# EAGLE design Espressylu-0.7 (EAGLE 7.4.0)
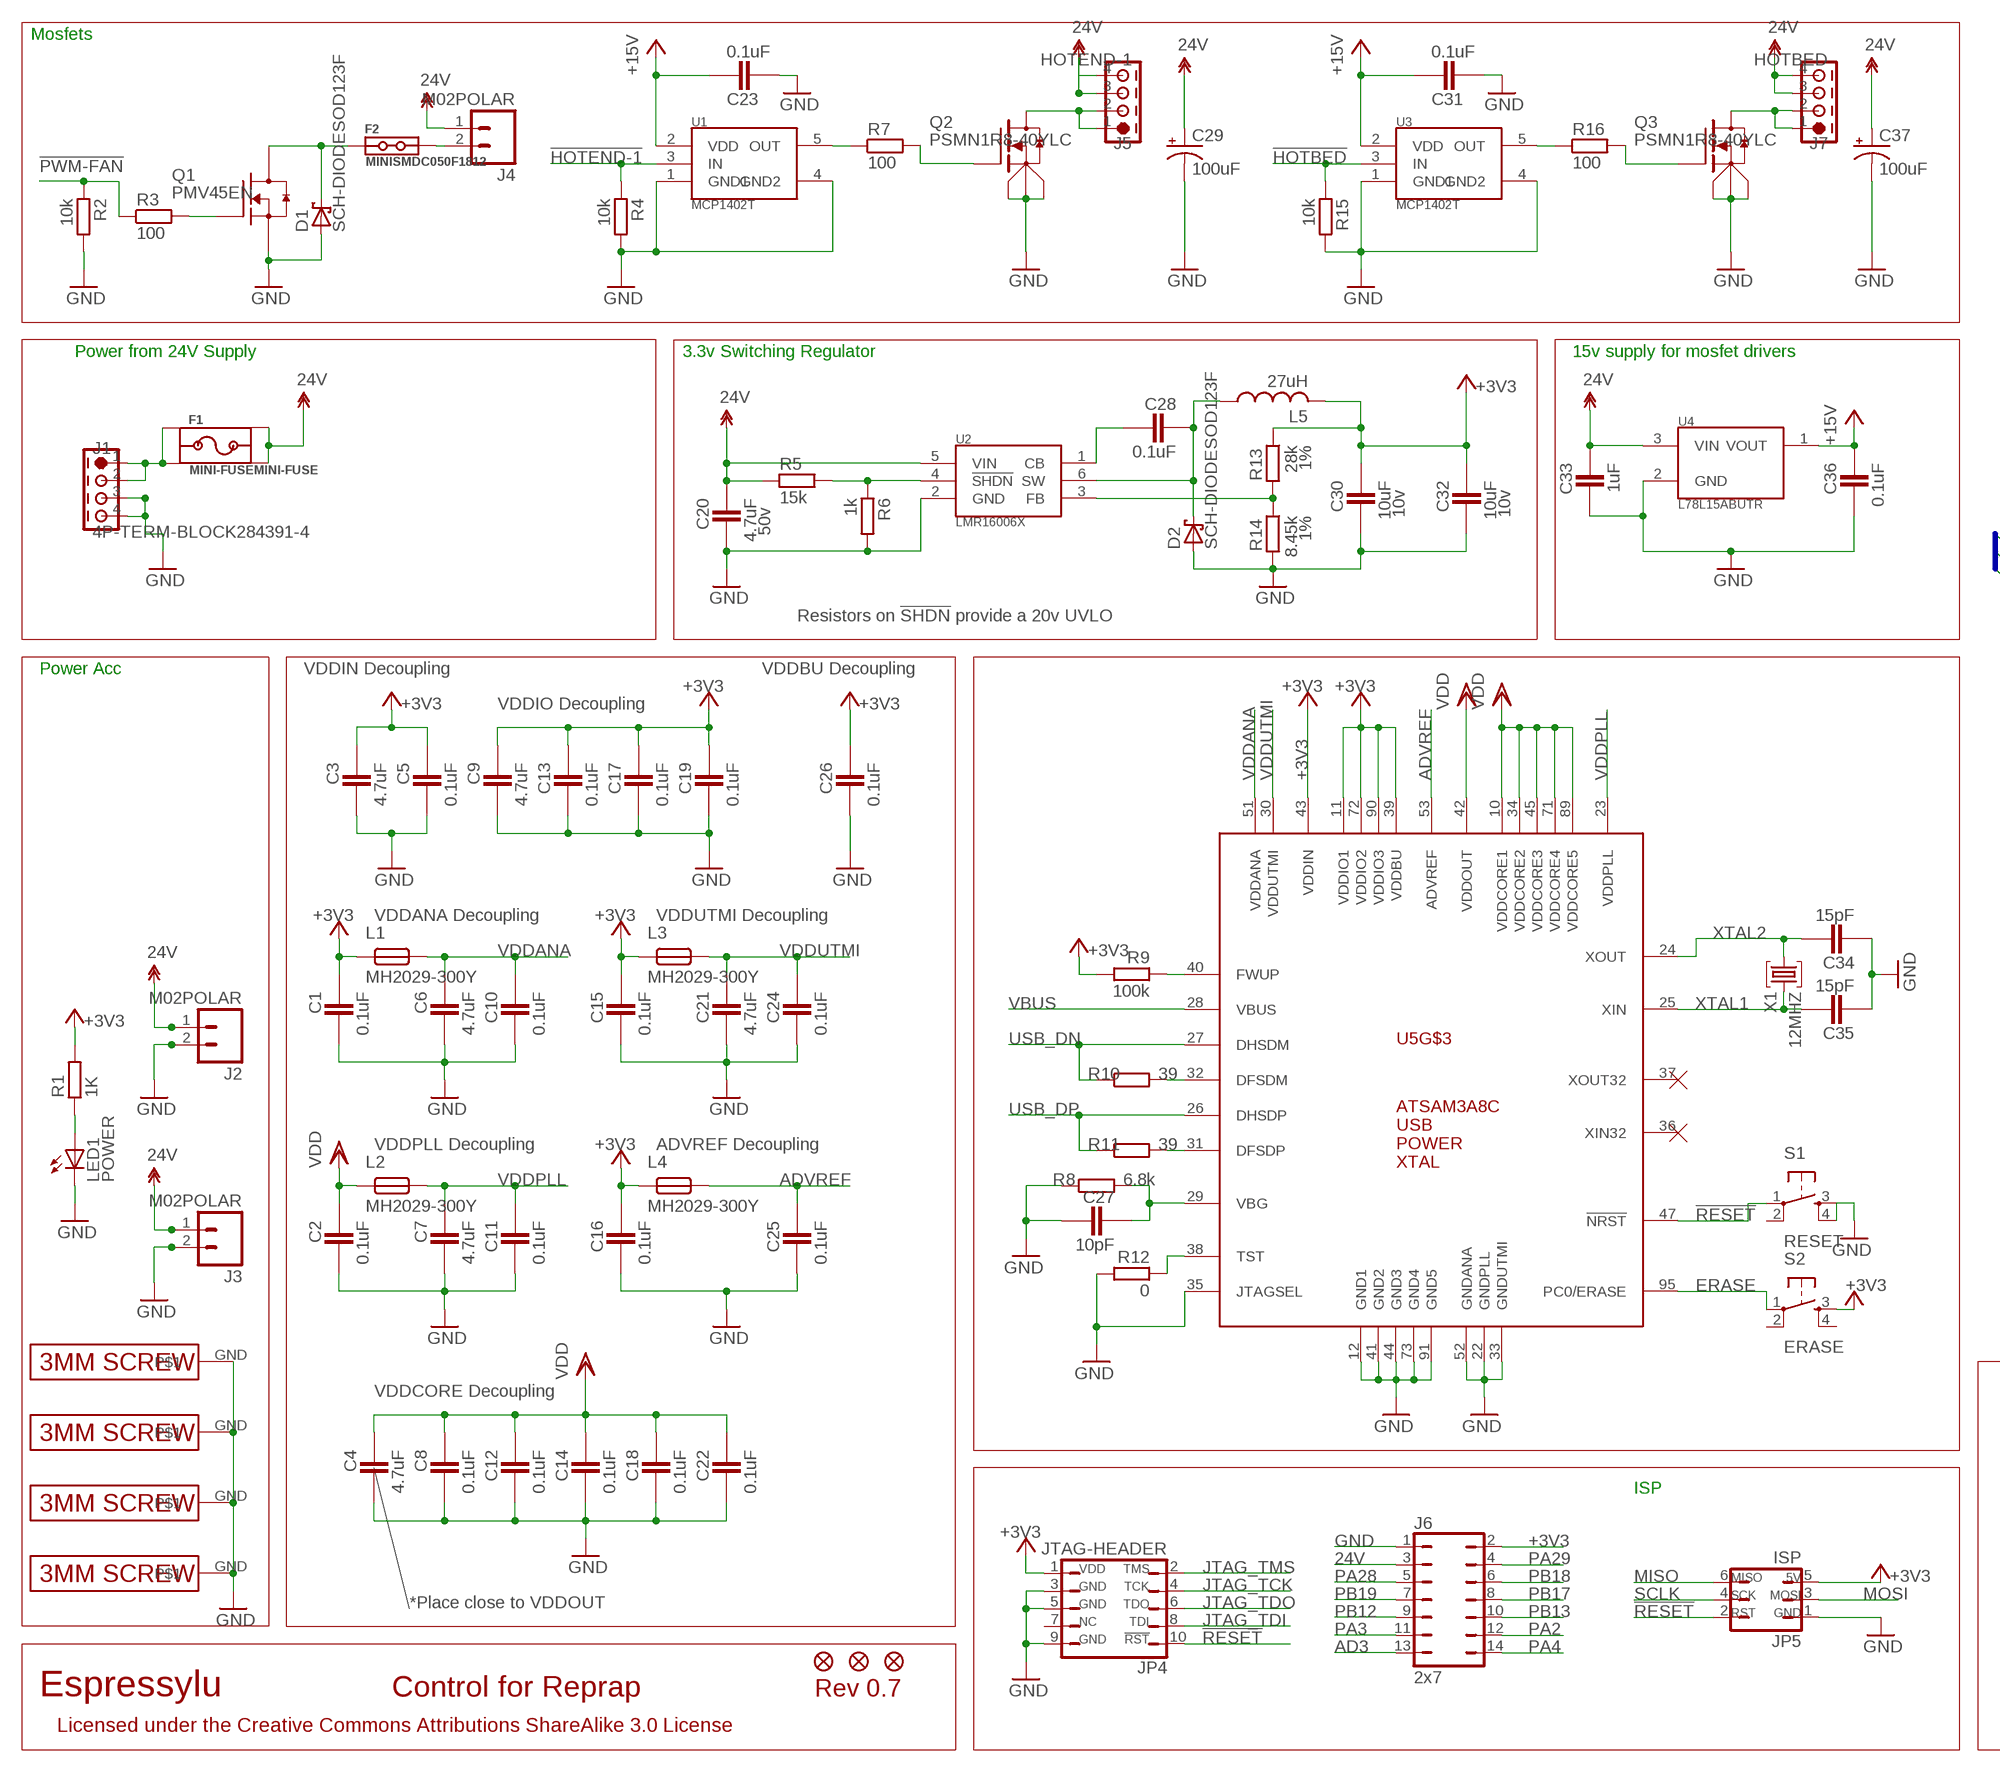
[diagram p0: schematic, sheet 1, part 1 of 2]
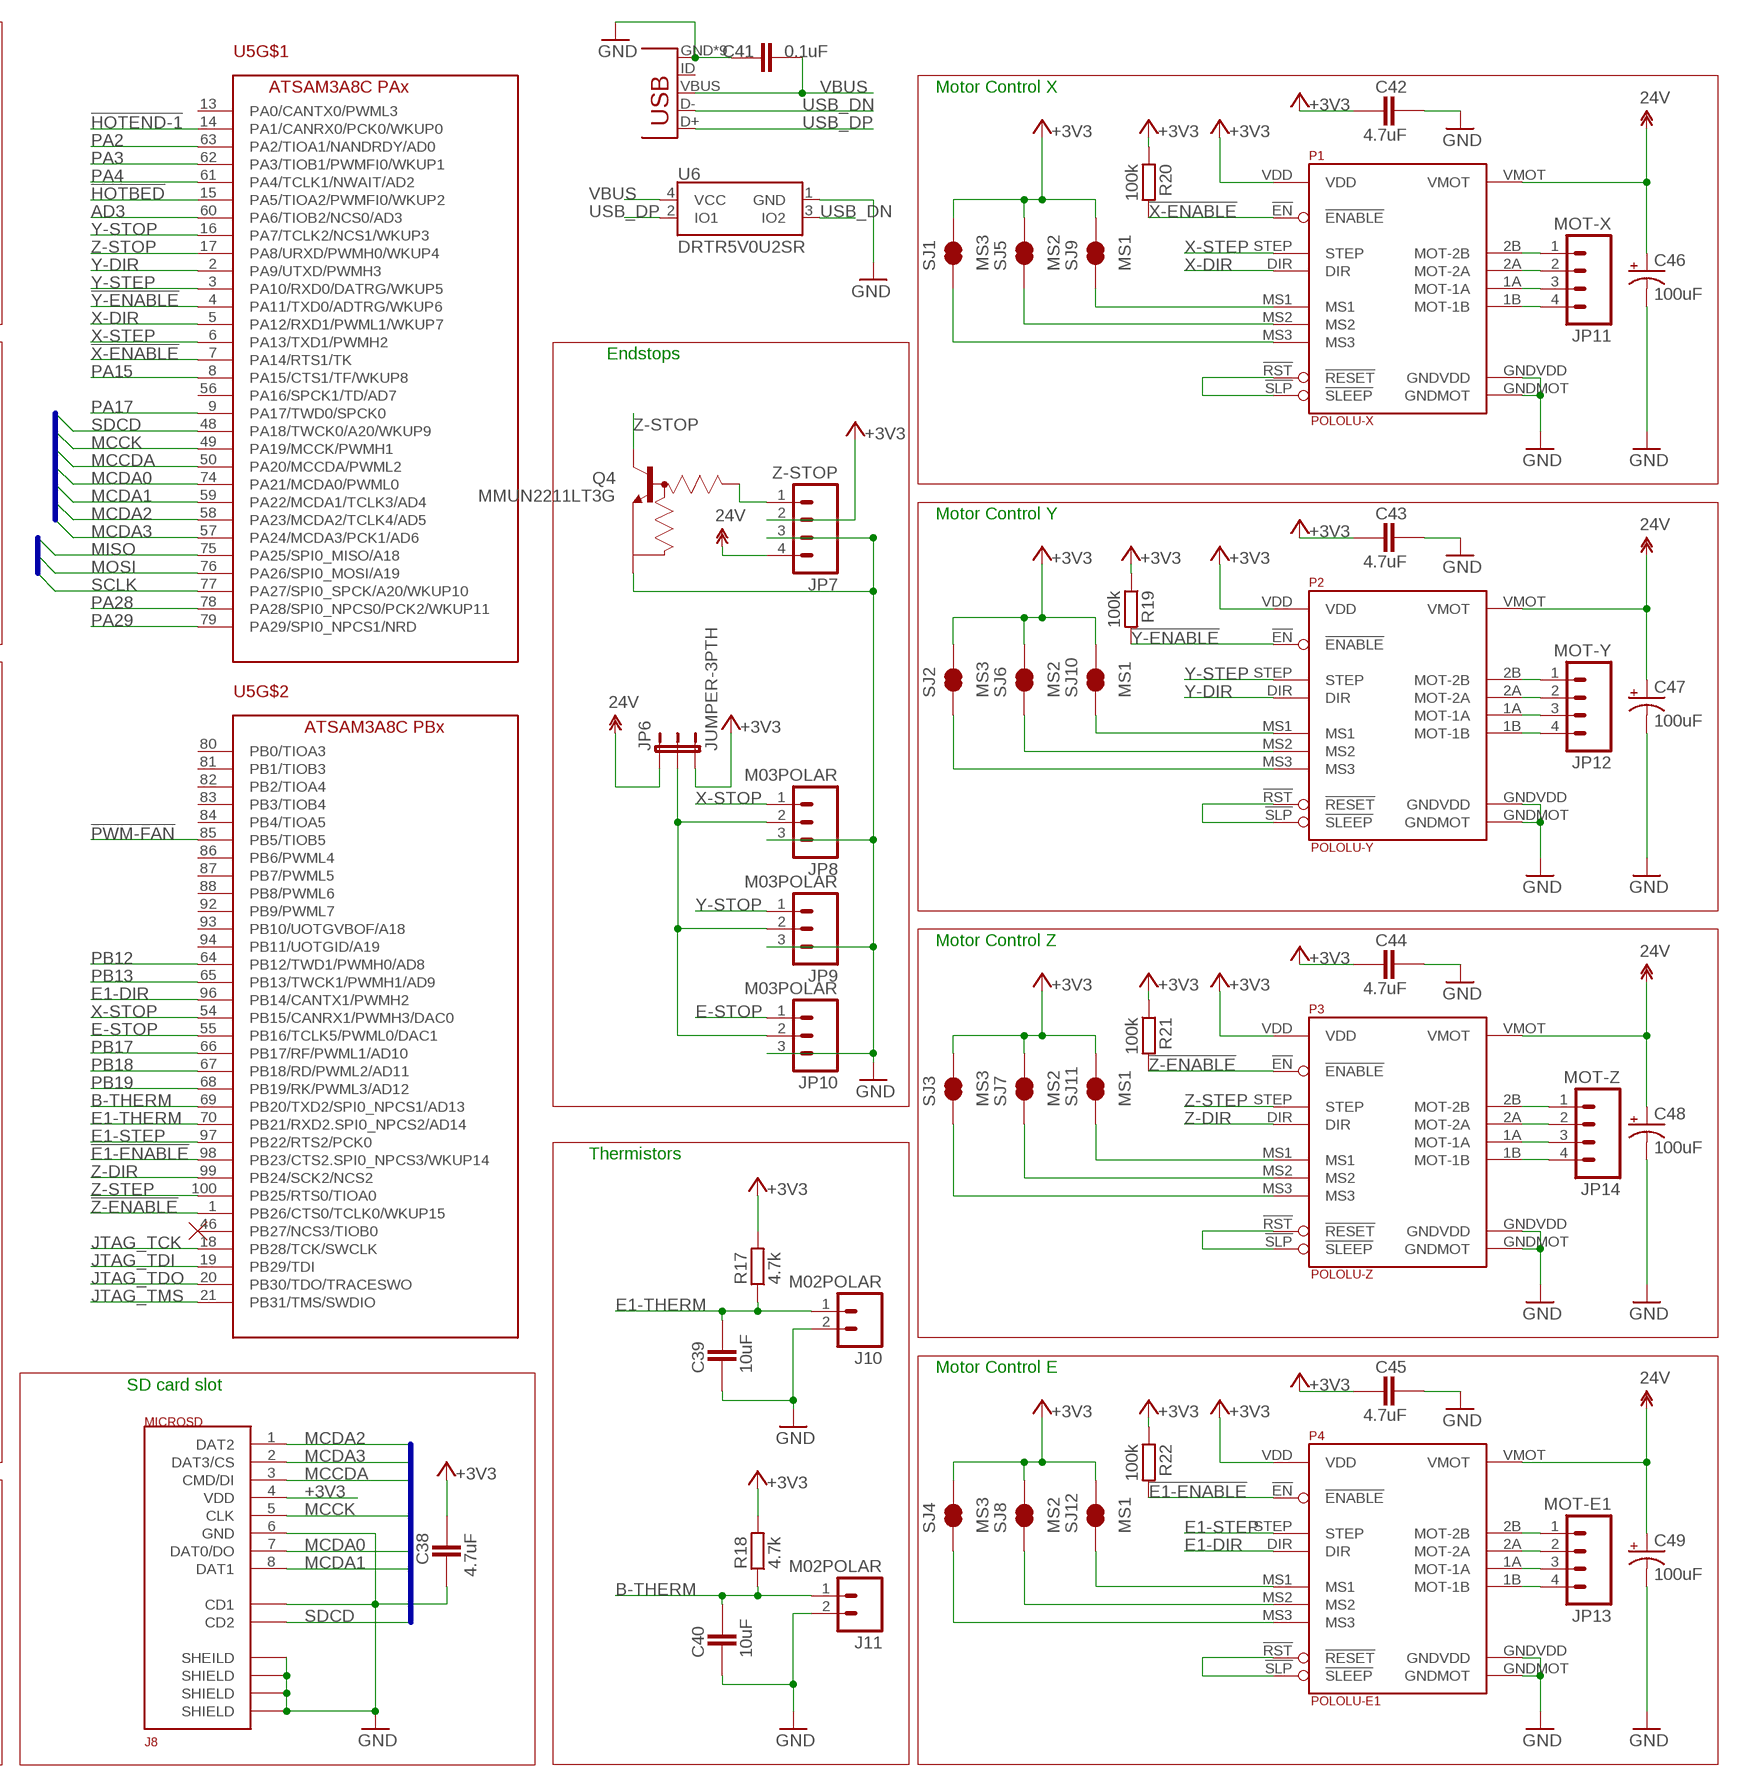
[diagram p1: schematic, sheet 1, part 2 of 2]

## Parts
C1  0.1uF  CAPACITOR_0402  [CAPC1005X60N]
C2  0.1uF  CAPACITOR_0402  [CAPC1005X60N]
C3  4.7uF  CAPACITOR_0603  [CAPC1608X92N]
C4  4.7uF  CAPACITOR_0603  [CAPC1608X92N]
C5  0.1uF  CAPACITOR_0402  [CAPC1005X60N]
C6  4.7uF  CAPACITOR_0603  [CAPC1608X92N]
C7  4.7uF  CAPACITOR_0603  [CAPC1608X92N]
C8  0.1uF  CAPACITOR_0402  [CAPC1005X60N]
C9  4.7uF  CAPACITOR_0603  [CAPC1608X92N]
C10  0.1uF  CAPACITOR_0402  [CAPC1005X60N]
C11  0.1uF  CAPACITOR_0402  [CAPC1005X60N]
C12  0.1uF  CAPACITOR_0402  [CAPC1005X60N]
C13  0.1uF  CAPACITOR_0402  [CAPC1005X60N]
C14  0.1uF  CAPACITOR_0402  [CAPC1005X60N]
C15  0.1uF  CAPACITOR_0402  [CAPC1005X60N]
C16  0.1uF  CAPACITOR_0402  [CAPC1005X60N]
C17  0.1uF  CAPACITOR_0402  [CAPC1005X60N]
C18  0.1uF  CAPACITOR_0402  [CAPC1005X60N]
C19  0.1uF  CAPACITOR_0402  [CAPC1005X60N]
C20  4.7uF  CAPACITOR_1206  [CAPC3215X168N]
C21  4.7uF  CAPACITOR_0603  [CAPC1608X92N]
C22  0.1uF  CAPACITOR_0402  [CAPC1005X60N]
C23  0.1uF  CAPACITOR_0402  [CAPC1005X60N]
C24  0.1uF  CAPACITOR_0402  [CAPC1005X60N]
C25  0.1uF  CAPACITOR_0402  [CAPC1005X60N]
C26  0.1uF  CAPACITOR_0402  [CAPC1005X60N]
C27  10pF  CAPACITOR_0402  [CAPC1005X60N]
C28  0.1uF  CAPACITOR_0402  [CAPC1005X60N]
C29  100uF  CPOL-USD  [PANASONIC_D]
C30  10uF  CAPACITOR_0805  [CAPC2012X145AN]
C31  0.1uF  CAPACITOR_0402  [CAPC1005X60N]
C32  10uF  CAPACITOR_0805  [CAPC2012X145AN]
C33  1uF  CAPACITOR_0402  [CAPC1005X60N]
C34  15pF  CAPACITOR_0402  [CAPC1005X60N]
C35  15pF  CAPACITOR_0402  [CAPC1005X60N]
C36  0.1uF  CAPACITOR_0402  [CAPC1005X60N]
C37  100uF  CPOL-USD  [PANASONIC_D]
C38  4.7uF  CAPACITOR_0603  [CAPC1608X92N]
C39  10uF  CAPACITOR_0402  [CAPC1005X60N]
C40  10uF  CAPACITOR_0402  [CAPC1005X60N]
C41  0.1uF  CAPACITOR_0402  [CAPC1005X60N]
C42  4.7uF  CAPACITOR_0603  [CAPC1608X92N]
C43  4.7uF  CAPACITOR_0603  [CAPC1608X92N]
C44  4.7uF  CAPACITOR_0603  [CAPC1608X92N]
C45  4.7uF  CAPACITOR_0603  [CAPC1608X92N]
C46  100uF  CPOL-USD  [PANASONIC_D]
C47  100uF  CPOL-USD  [PANASONIC_D]
C48  100uF  CPOL-USD  [PANASONIC_D]
C49  100uF  CPOL-USD  [PANASONIC_D]
D1  SCH-DIODESOD123F  [SOD123F]
D2  SCH-DIODESOD123F  [SOD123F]
F1  MINI-FUSEMINI-FUSE  [MINI_FUSE]
F2  MINISMDC050F1812  [MINISMDC]
J1  4P-TERM-BLOCK284391-4  [284391-4]
J2  M02POLAR  [MOLEX-1X2]
J3  M02POLAR  [MOLEX-1X2]
J4  M02POLAR  [MOLEX-1X2]
J5  HOTEND-1  4P-TERM-BLOCK284391-4  [284391-4]
J6  2x7  JP7Q  [JP7Q]
J7  HOTBED  4P-TERM-BLOCK284391-4  [284391-4]
J8  MICROSD  [AMPHENOL-MICROSD]
J9  USB-MICRO-PTH  [USB-MICROB-PTH]
J10  M02POLAR  [MOLEX-1X2]
J11  M02POLAR  [MOLEX-1X2]
JP1  FIDUCIAL1X2.5  [FIDUCIAL-1X2.5]
JP2  FIDUCIAL1X2.5  [FIDUCIAL-1X2.5]
JP3  FIDUCIAL1X2.5  [FIDUCIAL-1X2.5]
JP4  JTAG-HEADER  [2X05-0.5-SMD]
JP5  ISP  PROGHEADER  [ISP]
JP6  JUMPER-3PTH  [1X03]
JP7  Z-STOP  M04POLAR  [MOLEX-1X4]
JP8  M03POLAR  [MOLEX-1X3]
JP9  M03POLAR  [MOLEX-1X3]
JP10  M03POLAR  [MOLEX-1X3]
JP11  MOT-X  M04POLAR  [MOLEX-1X4]
JP12  MOT-Y  M04POLAR  [MOLEX-1X4]
JP13  MOT-E1  M04POLAR  [MOLEX-1X4]
JP14  MOT-Z  M04POLAR  [MOLEX-1X4]
L1  MH2029-300Y  FERRITE_BEAD_0805  [FERRITE_BEAD_0805]
L2  MH2029-300Y  FERRITE_BEAD_0805  [FERRITE_BEAD_0805]
L3  MH2029-300Y  FERRITE_BEAD_0805  [FERRITE_BEAD_0805]
L4  MH2029-300Y  FERRITE_BEAD_0805  [FERRITE_BEAD_0805]
L5  27uH  INDUCTORSDR0604  [SDR0604]
LED1  POWER  LEDCHIPLED_0805  [CHIPLED_0805]
P1  POLOLU-X  POLOLU-ALLEGRO  [POLOLU-STEPPER-PTH]
P2  POLOLU-Y  POLOLU-ALLEGRO  [POLOLU-STEPPER-PTH]
P3  POLOLU-Z  POLOLU-ALLEGRO  [POLOLU-STEPPER-PTH]
P4  POLOLU-E1  POLOLU-ALLEGRO  [POLOLU-STEPPER-PTH]
Q1  PMV45EN  MOSFET-NCH_SOT-23  [SOT23C]
Q2  PSMN1R8-40YLC  PSMN1R8-40YLCPOWERPACK-S08  [LFPACK-POWERPAK-SO8]
Q3  PSMN1R8-40YLC  PSMN1R8-40YLCPOWERPACK-S08  [LFPACK-POWERPAK-SO8]
Q4  MMUN2211LT3G  TRANSISTOR_NPN_BIASSOT23C  [SOT23C]
R1  1K  RESISTOR_0603  [RESC1608X55N]
R2  10k  RESISTOR_0402  [RESC1005X40AN]
R3  100  RESISTOR_0402  [RESC1005X40AN]
R4  10k  RESISTOR_0402  [RESC1005X40AN]
R5  15k  RESISTOR_0402  [RESC1005X40AN]
R6  1k  RESISTOR_0402  [RESC1005X40AN]
R7  100  RESISTOR_0402  [RESC1005X40AN]
R8  6.8k  RESISTOR_0402  [RESC1005X40AN]
R9  100k  RESISTOR_0402  [RESC1005X40AN]
R10  39  RESISTOR_0402  [RESC1005X40AN]
R11  39  RESISTOR_0402  [RESC1005X40AN]
R12  0  RESISTOR_0402  [RESC1005X40AN]
R13  28k  RESISTOR_0402  [RESC1005X40AN]
R14  8.45k  RESISTOR_0402  [RESC1005X40AN]
R15  10k  RESISTOR_0402  [RESC1005X40AN]
R16  100  RESISTOR_0402  [RESC1005X40AN]
R17  4.7k  RESISTOR_0402  [RESC1005X40AN]
R18  4.7k  RESISTOR_0402  [RESC1005X40AN]
R19  100k  RESISTOR_0402  [RESC1005X40AN]
R20  100k  RESISTOR_0402  [RESC1005X40AN]
R21  100k  RESISTOR_0402  [RESC1005X40AN]
R22  100k  RESISTOR_0402  [RESC1005X40AN]
S1  RESET  TAC_SWITCH_4P4P-SMD  [SWITCH-SMD-4P]
S2  ERASE  TAC_SWITCH_4P4P-SMD  [SWITCH-SMD-4P]
SCREW1  3MM-SCREW  [PLATEDSCREW]
SCREW2  3MM-SCREW  [PLATEDSCREW]
SCREW3  3MM-SCREW  [PLATEDSCREW]
SCREW4  3MM-SCREW  [PLATEDSCREW]
SJ1  MS3  SOLDERJUMPER-NCSJ-TRACE  [SJ_2S-TRACE]
SJ2  MS3  SOLDERJUMPER-NCSJ-TRACE  [SJ_2S-TRACE]
SJ3  MS3  SOLDERJUMPER-NCSJ-TRACE  [SJ_2S-TRACE]
SJ4  MS3  SOLDERJUMPER-NCSJ-TRACE  [SJ_2S-TRACE]
SJ5  MS2  SOLDERJUMPER-NCSJ-TRACE  [SJ_2S-TRACE]
SJ6  MS2  SOLDERJUMPER-NCSJ-TRACE  [SJ_2S-TRACE]
SJ7  MS2  SOLDERJUMPER-NCSJ-TRACE  [SJ_2S-TRACE]
SJ8  MS2  SOLDERJUMPER-NCSJ-TRACE  [SJ_2S-TRACE]
SJ9  MS1  SOLDERJUMPER-NCSJ-TRACE  [SJ_2S-TRACE]
SJ10  MS1  SOLDERJUMPER-NCSJ-TRACE  [SJ_2S-TRACE]
SJ11  MS1  SOLDERJUMPER-NCSJ-TRACE  [SJ_2S-TRACE]
SJ12  MS1  SOLDERJUMPER-NCSJ-TRACE  [SJ_2S-TRACE]
U1  MCP1402T  [SOT23-5]
U2  LMR16006X  [TSOT6]
U3  MCP1402T  [SOT23-5]
U4  L78L15ABUTR  [SOT89]
U5  ATSAM3A8C-LQFP100  [LQFP100]
U6  DRTR5V0U2SR  [SOT143-R]
X1  12MHZ  XTAL  [NDK-XTAL]

## Nets
5VREG_CB: C28.2 U2.1(CB)
5VREG_FB: R13.2 R14.1 U2.3(FB)
5VREG_SW: C28.1 D2.C L5.1 U2.6(SW)
12V_FUSE: F1.P$1 F1.P$2 J1.1 J1.2
24V: C20.1 C29.+ C33.1 C37.+ C46.+ C47.+ C48.+ C49.+ F1.P$3 F1.P$4 J2.1 J3.1 J4.1 J5.3 J5.4 J6.3 J7.3 J7.4 JP6.1 JP7.4 P1.VMOT P2.VMOT P3.VMOT P4.VMOT R5.1 U2.5(VIN) U4.3(VIN)
!E1-ENABLE: P4.!EN(!ENABLE) R22.2 U5.98(PB23/CTS2.SPI0_NPCS3/WKUP14)
!HOTBED: R15.1 U3.3(IN) U5.15(PA5/TIOA2/PWMFI0/WKUP2)
!HOTEND-1: R4.1 U1.3(IN) U5.14(PA1/CANRX0/PCK0/WKUP0)
!PWM-FAN: R2.1 R3.1 U5.85(PB5/TIOB5)
!RESET: JP4.10 JP5.2 S1.1 U5.47(!NRST)
!X-ENABLE: P1.!EN(!ENABLE) R20.2 U5.7(PA14/RTS1/TK)
!Y-ENABLE: P2.!EN(!ENABLE) R19.2 U5.4(PA11/TXD0/ADTRG/WKUP6)
!Z-ENABLE: P3.!EN(!ENABLE) R21.2 U5.1(PB26/CTS0/TCLK0/WKUP15)
+3V3 [power]: C1.1 C3.1 C5.1 C9.1 C13.1 C15.1 C16.1 C17.1 C19.1 C26.1 C30.1 C32.1 C38.1 C42.2 C43.2 C44.2 C45.2 J6.2 J8.4(VDD) JP4.1 JP5.5 JP6.3 JP7.2 L1.1 L3.1 L4.1 L5.2 P1.VDD P2.VDD P3.VDD P4.VDD R1.2 R9.2 R13.1 R17.2 R18.2 R19.1 R20.1 R21.1 R22.1 S2.3 SJ1.2 SJ2.2 SJ3.2 SJ4.2 SJ5.2 SJ6.2 SJ7.2 SJ8.2 SJ9.2 SJ10.2 SJ11.2 SJ12.2 U5.11(VDDIO1) U5.39(VDDBU) U5.43(VDDIN) U5.72(VDDIO2) U5.90(VDDIO3)
+15V: C23.1 C31.1 C36.1 U1.2(VDD) U3.2(VDD) U4.1(VOUT)
AD3: J6.13 U5.60(PA6/TIOB2/NCS0/AD3)
ADVREF [power]: C25.1 L4.2 U5.53(ADVREF)
B-THERM: C40.2 J11.1 R18.1 U5.69(PB20/TXD2/SPI0_NPCS1/AD13)
E1-DIR: P4.DIR U5.96(PB14/CANTX1/PWMH2)
E1-STEP: P4.STEP U5.97(PB22/RTS2/PCK0)
E1-THERM: C39.2 J10.1 R17.1 U5.70(PB21/RXD2.SPI0_NPCS2/AD14)
E-MOT-1A [power]: JP13.3 P4.1A(MOT-1A)
E-MOT-1B [power]: JP13.4 P4.1B(MOT-1B)
E-MOT-2A [power]: JP13.2 P4.2A(MOT-2A)
E-MOT-2B [power]: JP13.1 P4.2B(MOT-2B)
E-MS1: P4.MS1 SJ12.1
E-MS2: P4.MS2 SJ8.1
E-MS3: P4.MS3 SJ4.1
E-RESETSLEEP: P4.!RST(!RESET) P4.!SLP(!SLEEP)
E-STOP: JP10.1 U5.55(PB16/TCLK5/PWML0/DAC1)
ENDSTOP+V: JP6.2 JP8.2 JP9.2 JP10.2
ERASE: S2.1 U5.95(PC0/ERASE)
GND [power]: C1.2 C2.2 C3.2 C4.2 C5.2 C6.2 C7.2 C8.2 C9.2 C10.2 C11.2 C12.2 C13.2 C14.2 C15.2 C16.2 C17.2 C18.2 C19.2 C20.2 C21.2 C22.2 C23.2 C24.2 C25.2 C26.2 C27.2 C29.- C30.2 C31.2 C32.2 C33.2 C34.1 C35.1 C36.2 C37.- C38.2 C39.1 C40.1 C41.1 C42.1 C43.1 C44.1 C45.1 C46.- C47.- C48.- C49.- D1.A D2.A J1.3 J1.4 J2.2 J3.2 J6.1 J8.6(GND) J8.C1(SHEILD) J8.C2(SHIELD) J8.C3(SHIELD) J8.C4(SHIELD) J8.CD1 J9.GND J9.GND1(GND) J9.GND2(GND) J9.GND3(GND) J9.GND4(GND) J9.GND5(GND) J9.GND6(GND) J9.GND7(GND) J9.GND8(GND) J10.2 J11.2 JP4.3 JP4.5 JP4.9 JP5.1 JP7.3 JP8.3 JP9.3 JP10.3 LED1.C P1.GNDMOT P1.GNDVDD P2.GNDMOT P2.GNDVDD P3.GNDMOT P3.GNDVDD P4.GNDMOT P4.GNDVDD Q1.2(S) Q2.1(S1) Q2.2(S2) Q2.3(S3) Q3.1(S1) Q3.2(S2) Q3.3(S3) Q4.2(E) R2.2 R4.2 R6.2 R8.1 R12.2 R14.2 R15.2 S1.3 S1.4 SCREW1.GND SCREW2.GND SCREW3.GND SCREW4.GND U1.1(GND1) U1.4(GND2) U2.2(GND) U3.1(GND1) U3.4(GND2) U4.2(GND) U5.12(GND1) U5.22(GNDPLL) U5.33(GNDUTMI) U5.35(JTAGSEL) U5.41(GND2) U5.44(GND3) U5.52(GNDANA) U5.73(GND4) U5.91(GND5) U6.1(GND)
HOTBED-GND [power]: J7.1 J7.2 Q3.5-8(D)
HOTEND-GND [power]: J5.1 J5.2 Q2.5-8(D)
JTAG_TCK: JP4.4 U5.18(PB28/TCK/SWCLK)
JTAG_TDI: JP4.8 U5.19(PB29/TDI)
JTAG_TDO: JP4.6 U5.20(PB30/TDO/TRACESWO)
JTAG_TMS: JP4.2 U5.21(PB31/TMS/SWDIO)
MCCDA: J8.3(CMD/DI) U5.50(PA20/MCCDA/PWML2)
MCCK: J8.5(CLK) U5.49(PA19/MCCK/PWMH1)
MCDA0: J8.7(DAT0/DO) U5.74(PA21/MCDA0/PWML0)
MCDA1: J8.8(DAT1) U5.59(PA22/MCDA1/TCLK3/AD4)
MCDA2: J8.1(DAT2) U5.58(PA23/MCDA2/TCLK4/AD5)
MCDA3: J8.2(DAT3/CS) U5.57(PA24/MCDA3/PCK1/AD6)
MISO: JP5.6 U5.75(PA25/SPI0_MISO/A18)
MOSI: JP5.3 U5.76(PA26/SPI0_MOSI/A19)
N$1: LED1.A R1.1
N$2: Q3.4(G) R16.2
N$3: R5.2 R6.1 U2.4(!SHDN)
N$4: R9.1 U5.40(FWUP)
N$5: F2.P$2 J4.2
N$6: D1.C F2.P$1 Q1.3(D)
N$7: R12.1 U5.38(TST)
N$9: R10.2 U5.32(DFSDM)
N$10: Q1.1(G) R3.2
N$11: Q2.4(G) R7.2
N$12: R11.2 U5.31(DFSDP)
N$14: R16.1 U3.5(OUT)
N$15: R7.1 U1.5(OUT)
PA2: J6.12 U5.63(PA2/TIOA1/NANDRDY/AD0)
PA3: J6.11 U5.62(PA3/TIOB1/PWMFI0/WKUP1)
PA4: J6.14 U5.61(PA4/TCLK1/NWAIT/AD2)
PA15: U5.8(PA15/CTS1/TF/WKUP8)
PA17: U5.9(PA17/TWD0/SPCK0)
PA28: J6.5 U5.78(PA28/SPI0_NPCS0/PCK2/WKUP11)
PA29: J6.4 U5.79(PA29/SPI0_NPCS1/NRD)
PB12: J6.9 U5.64(PB12/TWD1/PWMH0/AD8)
PB13: J6.10 U5.65(PB13/TWCK1/PWMH1/AD9)
PB17: J6.8 U5.66(PB17/RF/PWML1/AD10)
PB18: J6.6 U5.67(PB18/RD/PWML2/AD11)
PB19: J6.7 U5.68(PB19/RK/PWML3/AD12)
SCLK: JP5.4 U5.77(PA27/SPI0_SPCK/A20/WKUP10)
SDCD: J8.CD2 U5.48(PA18/TWCK0/A20/WKUP9)
USB_DN: J9.D- R10.1 U5.27(DHSDM) U6.3(IO2)
USB_DP: J9.D+ R11.1 U5.26(DHSDP) U6.2(IO1)
VBG: C27.1 R8.2 U5.29(VBG)
VBUS: C41.2 J9.VBUS U5.28(VBUS) U6.4(VCC)
VDD [power]: C2.1 C4.1 C8.1 C12.1 C14.1 C18.1 C22.1 L2.1 U5.10(VDDCORE1) U5.34(VDDCORE2) U5.42(VDDOUT) U5.45(VDDCORE3) U5.71(VDDCORE4) U5.89(VDDCORE5)
VDDANA [power]: C6.1 C10.1 L1.2 U5.51(VDDANA)
VDDPLL [power]: C7.1 C11.1 L2.2 U5.23(VDDPLL)
VDDUTMI [power]: C21.1 C24.1 L3.2 U5.30(VDDUTMI)
X-DIR: P1.DIR U5.5(PA12/RXD1/PWML1/WKUP7)
X-MOT-1A [power]: JP11.3 P1.1A(MOT-1A)
X-MOT-1B [power]: JP11.4 P1.1B(MOT-1B)
X-MOT-2A [power]: JP11.2 P1.2A(MOT-2A)
X-MOT-2B [power]: JP11.1 P1.2B(MOT-2B)
X-MS1: P1.MS1 SJ9.1
X-MS2: P1.MS2 SJ5.1
X-MS3: P1.MS3 SJ1.1
X-RESETSLEEP: P1.!RST(!RESET) P1.!SLP(!SLEEP)
X-STEP: P1.STEP U5.6(PA13/TXD1/PWMH2)
X-STOP: JP8.1 U5.54(PB15/CANRX1/PWMH3/DAC0)
XTAL1: C35.2 U5.25(XIN) X1.P$2
XTAL2: C34.2 U5.24(XOUT) X1.P$1
Y-DIR: P2.DIR U5.2(PA9/UTXD/PWMH3)
Y-MOT-1A [power]: JP12.3 P2.1A(MOT-1A)
Y-MOT-1B [power]: JP12.4 P2.1B(MOT-1B)
Y-MOT-2A [power]: JP12.2 P2.2A(MOT-2A)
Y-MOT-2B [power]: JP12.1 P2.2B(MOT-2B)
Y-MS1: P2.MS1 SJ10.1
Y-MS2: P2.MS2 SJ6.1
Y-MS3: P2.MS3 SJ2.1
Y-RESETSLEEP: P2.!RST(!RESET) P2.!SLP(!SLEEP)
Y-STEP: P2.STEP U5.3(PA10/RXD0/DATRG/WKUP5)
Y-STOP: JP9.1 U5.16(PA7/TCLK2/NCS1/WKUP3)
Z-DIR: P3.DIR U5.99(PB24/SCK2/NCS2)
Z-MOT-1A [power]: JP14.3 P3.1A(MOT-1A)
Z-MOT-1B [power]: JP14.4 P3.1B(MOT-1B)
Z-MOT-2A [power]: JP14.2 P3.2A(MOT-2A)
Z-MOT-2B [power]: JP14.1 P3.2B(MOT-2B)
Z-MS1: P3.MS1 SJ11.1
Z-MS2: P3.MS2 SJ7.1
Z-MS3: P3.MS3 SJ3.1
Z-RESETSLEEP: P3.!RST(!RESET) P3.!SLP(!SLEEP)
Z-STEP: P3.STEP U5.100(PB25/RTS0/TIOA0)
Z-STOP: Q4.3(C) U5.17(PA8/URXD/PWMH0/WKUP4)
Z-STOP-BIAS: JP7.1 Q4.1(B)
Unconnected: J9.ID JP4.7 S1.2 S2.2 S2.4 U5.13(PA0/CANTX0/PWML3) U5.36(XIN32) U5.37(XOUT32) U5.46(PB27/NCS3/TIOB0) U5.56(PA16/SPCK1/TD/AD7) U5.80(PB0/TIOA3) U5.81(PB1/TIOB3) U5.82(PB2/TIOA4) U5.83(PB3/TIOB4) U5.84(PB4/TIOA5) U5.86(PB6/PWML4) U5.87(PB7/PWML5) U5.88(PB8/PWML6) U5.92(PB9/PWML7) U5.93(PB10/UOTGVBOF/A18) U5.94(PB11/UOTGID/A19)

## Buses
SDCD,MCCK,MCCDA,MCDA[0..3]
MISO,MOSI,SCLK

## Notes on the sheet
- Mosfets
- Motor Control X
- Power from 24V Supply | 3.3v Switching Regulator | 15v supply for mosfet drivers | Endstops
- Motor Control Y
- Resistors on !SHDN! provide a 20v UVLO
- Power Acc | VDDIN Decoupling | VDDBU Decoupling
- VDDIO Decoupling
- VDDANA Decoupling | VDDUTMI Decoupling
- Motor Control Z
- VDDPLL Decoupling | ADVREF Decoupling | Thermistors
- Motor Control E
- SD card slot
- VDDCORE Decoupling
- ISP
- *Place close to VDDOUT
- Espressylu | Control for Reprap | Rev 0.7
- Licensed under the Creative Commons Attributions ShareAlike 3.0 License

## Library data of the parts
C1 C2 C5 C8 C10-C19 C22 C24-C26 = teensylu:CAPACITOR_; MANUFACTURER: Samsung; MANUFACTURER_PART_NUMBER: CL05A104KQ5NNNC; TOLERANCE: 10%; VDC: 6.3V
C3 C4 C6 C7 C9 C21 C38 C42-C45 = teensylu:CAPACITOR_; MANUFACTURER: Samsung; MANUFACTURER_PART_NUMBER: CL10B475KQ8NQNC; TOLERANCE: 10%; VDC: 6.3V
C20 = teensylu:CAPACITOR_; MANUFACTURER: Yaiyo Yuden; MANUFACTURER_PART_NUMBER: UMK316AB7475KL-T; TOLERANCE: 10%; VDC: 50v
C23 C31 C33 C36 = teensylu:CAPACITOR_; TOLERANCE: 20%; VDC: 50V
C27 = teensylu:CAPACITOR_; MANUFACTURER: Samsung; MANUFACTURER_PART_NUMBER: CL10C100JB8NCNC; TOLERANCE: 5%; VDC: 50V
C28 = teensylu:CAPACITOR_; MANUFACTURER: Samsung; MANUFACTURER_PART_NUMBER: CL10B104KB8NNNC; TOLERANCE: 10%; VDC: 50V
C29 C37 C46-C49 = teensylu:CPOL-US: POLARIZED CAPACITOR, American symbol; MANUFACTURER: Panasonic; MANUFACTURER_PART_NUMBER: EEE-FTH101XAP; TOLERANCE: 20%; VDC: 50v
C30 C32 = teensylu:CAPACITOR_; ESR: 0.0030; MANUFACTURER: Murata; MANUFACTURER_PART_NUMBER: GRM21BR71A106KE51L; TOLERANCE: 10%; VDC: 10v
C34 C35 = teensylu:CAPACITOR_; MANUFACTURER: Samsung; MANUFACTURER_PART_NUMBER: CL05C150JB5NNNC; TOLERANCE: 5%; VDC: 50V
C39 C40 = teensylu:CAPACITOR_; MANUFACTURER: Murata; MANUFACTURER_PART_NUMBER: GRM188R61C106MA73D; TOLERANCE: 20%; VDC: 16V
C41 = teensylu:CAPACITOR_; MANUFACTURER: Murata; MANUFACTURER_PART_NUMBER: GRM188R71C104KA01D; TOLERANCE: 10%; VDC: 16V
D1 D2 = teensylu:SCH-DIODE: Schottky Diodes Source: Fairchild .. BAT54.pdf; CURRENT: 1A; MANUFACTURER: NXP Semiconductors; MANUFACTURER_PART_NUMBER: PMEG4010CEH,115; REVERSE_VOLTAGE: 40V
F1 = teensylu:MINI-FUSE; CURRENT: 15A; MANUFACTURER: Keystone; MANUFACTURER_PART_NUMBER: 3568
F2 = teensylu:MINISMDC050F; CURRENT: 0.5A; MANUFACTURER: TE Connectivity; MANUFACTURER_PART_NUMBER: MINISMDC050F-2
J1 J5 J7 = teensylu:4P-TERM-BLOCK; CURRENT: 12A; MANUFACTURER: TE Connectivity; MANUFACTURER_PART_NUMBER: 284391-4
J2-J4 J10 J11 = teensylu:M02: Header 2 Standard 2-pin 0.1" header. Use with straight break away headers (SKU : PRT-00116), right angle break away headers (PRT-00553), swiss pins (PRT-00743), machine pins (PRT-00117), and female headers (PRT-00115). Molex polarized connector foot print use with SKU : PRT-08233 with associated crimp pins and housings.; DESCRIPTION: CONN HEADER 2POS .100 VERT TIN; MANUFACTURER: Molex; MANUFACTURER_PART_NUMBER: 0022272021; NOTES: Can use alternative part for Right Angle. MFG: TE Connectivity PN: 640455-2
J6 = teensylu:JP7Q: JUMPER; DESCRIPTION: DIL VERTICAL PC TAIL PIN HEADER; MANUFACTURER: Harwin; MANUFACTURER_PART_NUMBER: M20-9980746
J8 = teensylu:MICROSD; DESCRIPTION: CONN MICRO SD CARD PUSH-PULL R/A; MANUFACTURER: Amphenol; MANUFACTURER_PART_NUMBER: 114-00841-68
J9 = teensylu:USB: USB Connectors USB-B-PTH is fully proven SKU : PRT-00139 USB-miniB is fully proven SKU : PRT-00587 USB-A-PCB is untested. USB-A-H is throughly reviewed, but untested. Spark Fun Electronics SKU : PRT-00437 USB-B-SMT is throughly reviewed, but untested. Needs silkscreen touching up. USB-A-S has not been used/tested USB-MB-H has not been used/tested; MANUFACTURER: FCI; MANUFACTURER_PART_NUMBER: 10118194-0001LF
JP1-JP3 = SparkFun:FIDUCIAL: Fiducial Alignment Points Various fiducial points for machine vision alignment.
JP4 = teensylu:JTAG-HEADER; DESCRIPTION: CONN HEADER 10POS DL UNSHRD SMD; MANUFACTURER: FCI; MANUFACTURER_PART_NUMBER: 20021121-00010C4LF
JP5 = teensylu:PROGHEADER: JUMPER
JP6 = teensylu:JUMPER-3
JP7 JP11-JP14 = teensylu:M04: Header 4 Standard 4-pin 0.1" header. Use with straight break away headers (SKU : PRT-00116), right angle break away headers (PRT-00553), swiss pins (PRT-00743), machine pins (PRT-00117), and female headers (PRT-00115). Molex polarized connector foot print use with SKU : PRT-08231 with associated crimp pins and housings. 1MM SMD Version SKU: PRT-10208; DESCRIPTION: CONN HEADER 4POS .100 VERT TIN; MANUFACTURER: Molex; MANUFACTURER_PART_NUMBER: 0022272041; NOTES: Can use alternative part for Right Angle. MFG: TE Connectivity PN: 640455-4
JP8-JP10 = teensylu:M03: Header 3 Standard 3-pin 0.1" header. Use with straight break away headers (SKU : PRT-00116), right angle break away headers (PRT-00553), swiss pins (PRT-00743), machine pins (PRT-00117), and female headers (PRT-00115). Molex polarized connector foot print use with SKU : PRT-08232 with associated crimp pins and housings.; DESCRIPTION: CONN HEADER 3POS .100 VERT TIN; MANUFACTURER: Molex; MANUFACTURER_PART_NUMBER: 0022272031; NOTES: Can use alternative part for Right Angle. MFG: TE Connectivity PN: 640455-3
L1-L4 = teensylu:FERRITE_BEAD: SMD EMI Suppression Ferrite Beads - excellent anti-EMI properties - low DCR - impedances till 3000 ohms - rated current up to 6 A; DESCRIPTION: 30 Ohm @ 100MHz; MANUFACTURER: Bourns Inc; MANUFACTURER_PART_NUMBER: MH2029-300Y
L5 = teensylu:INDUCTOR; DCR: 0.22; IRMS: 1A; MANUFACTURER: Bourns; MANUFACTURER_PART_NUMBER: SDR0604-270YL
LED1 = teensylu:LED: LED OSRAM: - CHIPLED LG R971, LG N971, LY N971, LG Q971, LY Q971, LO R971, LY R971 LH N974, LH R974 LS Q976, LO Q976, LY Q976 LO Q996 - Hyper CHIPLED LW Q18S LB Q993, LB Q99A, LB R99A - SideLED LS A670, LO A670, LY A670, LG A670, LP A670 LB A673, LV A673, LT A673, LW A673 LH A674 LY A675 LS A676, LA A676, LO A676, LY A676, LW A676 LS A679, LY A679, LG A679 - Hyper Micro SIDELED® LS Y876, LA Y876, LO Y876, LY Y876 LT Y87S - SmartLED LW L88C, LW L88S LB L89C, LB L89S, LG L890 LS L89K, LO L89K, LY L89K LS L896, LA L896, LO L896, LY L896 - TOPLED LS T670, LO T670, LY T670, LG T670, LP T670 LSG T670, LSP T670, LSY T670, LOP T670, LYG T670 LG T671, LOG T671, LSG T671 LB T673, LV T673, LT T673, LW T673 LH T674 LS T676, LA T676, LO T676, LY T676, LB T676, LH T676, LSB T676, LW T676 LB T67C, LV T67C, LT T67C, LS T67K, LO T67K, LY T67K, LW E67C LS E67B, LA E67B, LO E67B, LY E67B, LB E67C, LV E67C, LT E67C LW T67C LS T679, LY T679, LG T679 LS T770, LO T770, LY T770, LG T770, LP T770 LB T773, LV T773, LT T773, LW T773 LH T774 LS E675, LA E675, LY E675, LS T675 LS T776, LA T776, LO T776, LY T776, LB T776 LHGB T686 LT T68C, LB T68C - Hyper Mini TOPLED® LB M676 - Mini TOPLED Santana® LG M470 LS M47K, LO M47K, LY M47K Source: http://www.osram.convergy.de LUXEON: - LUMILED® LXK2-PW12-R00, LXK2-PW12-S00, LXK2-PW14-U00, LXK2-PW14-V00 LXK2-PM12-R00, LXK2-PM12-S00, LXK2-PM14-U00 LXK2-PE12-Q00, LXK2-PE12-R00, LXK2-PE12-S00, LXK2-PE14-T00, LXK2-PE14-U00 LXK2-PB12-K00, LXK2-PB12-L00, LXK2-PB12-M00, LXK2-PB14-N00, LXK2-PB14-P00, LXK2-PB14-Q00 LXK2-PR12-L00, LXK2-PR12-M00, LXK2-PR14-Q00, LXK2-PR14-R00 LXK2-PD12-Q00, LXK2-PD12-R00, LXK2-PD12-S00 LXK2-PH12-R00, LXK2-PH12-S00 LXK2-PL12-P00, LXK2-PL12-Q00, LXK2-PL12-R00 Source: www.luxeon.com KINGBRIGHT: KA-3528ASYC Source: www.kingbright.com; MANUFACTURER: Kingbright; MANUFACTURER_PART_NUMBER: APT2012SGC
P1-P4 = teensylu:POLOLU-ALLEGRO
Q1 = teensylu:MOSFET-NCH_; CURRENT: 1.2A; MANUFACTURER: International Rectifier; MANUFACTURER_PART_NUMBER: IRLML2060TRPBF; VOLTAGE: 60V
Q2 Q3 = teensylu:PSMN1R8-40YLC: N-Channel MOSFET - 40V 100A LFPAK; CURRENT: 100A; MANUFACTURER: NXP Semiconductors; MANUFACTURER_PART_NUMBER: PSMN1R8-40YLC,115; RDS_ON: 1.8mOhm; VGS: 1.95V; VOLTAGE: 40V
Q4 = teensylu:TRANSISTOR_NPN_BIAS: Transistor NPN BJT configuration in SOT23 package. MMBT2222 is the common NPN we use. Double check BCE configuration again layout.; DESCRIPTION: TRANS PREBIAS NPN 246MW SOT23-3; MANUFACTURER: ON Semiconductor; MANUFACTURER_PART_NUMBER: MMUN2211LT3G
R1-R7 R9 R12 R15-R22 = teensylu:RESISTOR_
R8 R10 R11 R13 R14 = teensylu:RESISTOR_; TOLERANCE: 1%
S1 S2 = teensylu:TAC_SWITCH_4P: Momentary Switch Button commonly used for reset or general input. Spark Fun Electronics SKU : COM-00097; MANUFACTURER: TE Connectivity; MANUFACTURER_PART_NUMBER: FSM6JSMA
SCREW1-SCREW4 = teensylu:3MM-SCREW: 3mm Plated Through Hole Screw
SJ1-SJ12 = teensylu:SOLDERJUMPER-NC
U1 U3 = teensylu:MCP1402T; DESCRIPTION: IC MOSFET DRIVER 500MA SOT23-5; MANUFACTURER: Microchip; MANUFACTURER_PART_NUMBER: MCP1402T-E/OT
U2 = teensylu:LMR16006X: Texas Instruments LMR16006XDDCT; CURRENT: 600mA; MANUFACTURER: Texas Instruments; MANUFACTURER_PART_NUMBER: LMR16006XDDCT
U4 = teensylu:L78L15ABUTR; DESCRIPTION: IC REG LDO 15V 0.1A SOT89-3; MANUFACTURER: STMicroelectronics; MANUFACTURER_PART_NUMBER: L78L15ABUTR
U5 = teensylu:ATSAM3A8C; MANUFACTURER: Atmel; MANUFACTURER_PART_NUMBER: ATSAM3A8C
U6 = teensylu:DRTR5V0U2SR: Diodes Incorporated DRTR5V0U2SR; DESCRIPTION: 2 CHANNEL LOW CAPACITANCE TVS DIODE ARRAY; MANUFACTURER: Diodes Incorporated; MANUFACTURER_PART_NUMBER: DTR5V0U2SR
X1 = teensylu:XTAL; MANUFACTURER: Abracon LLC; MANUFACTURER_PART_NUMBER: ABM3-12.000MHZ-B2-T

## Net classes
0 default: width 0.254 mm, drill 0.4 mm, clearance 0.203 mm
1 power: width 0.61 mm, drill 0.5 mm, clearance 0.203 mm

## Board
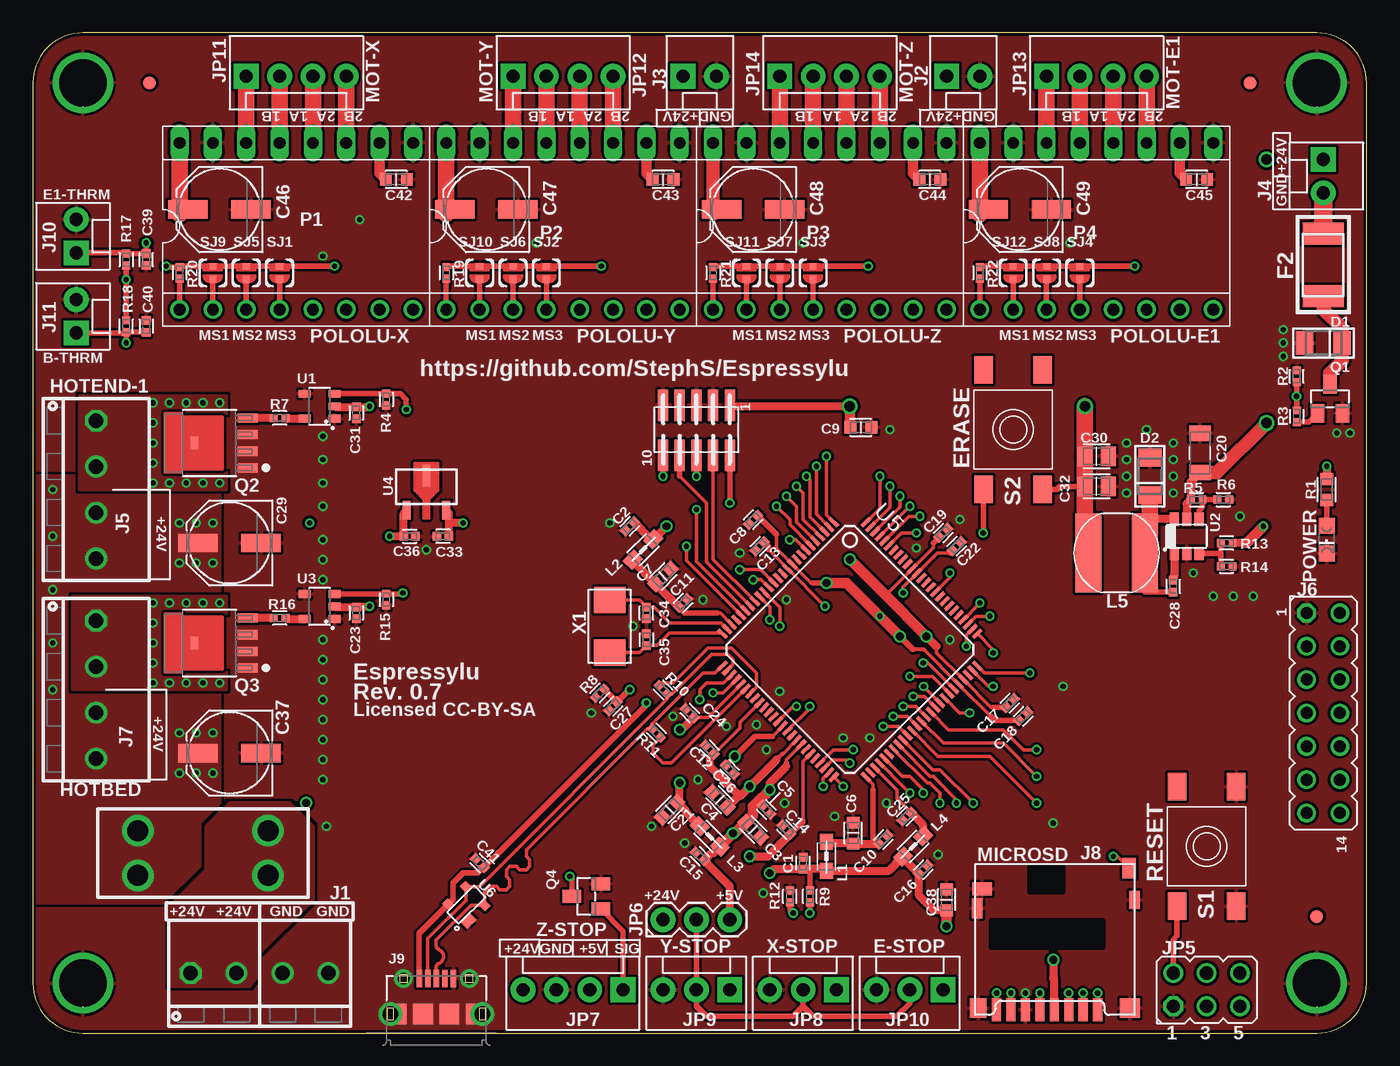
[diagram p2: board, top side]
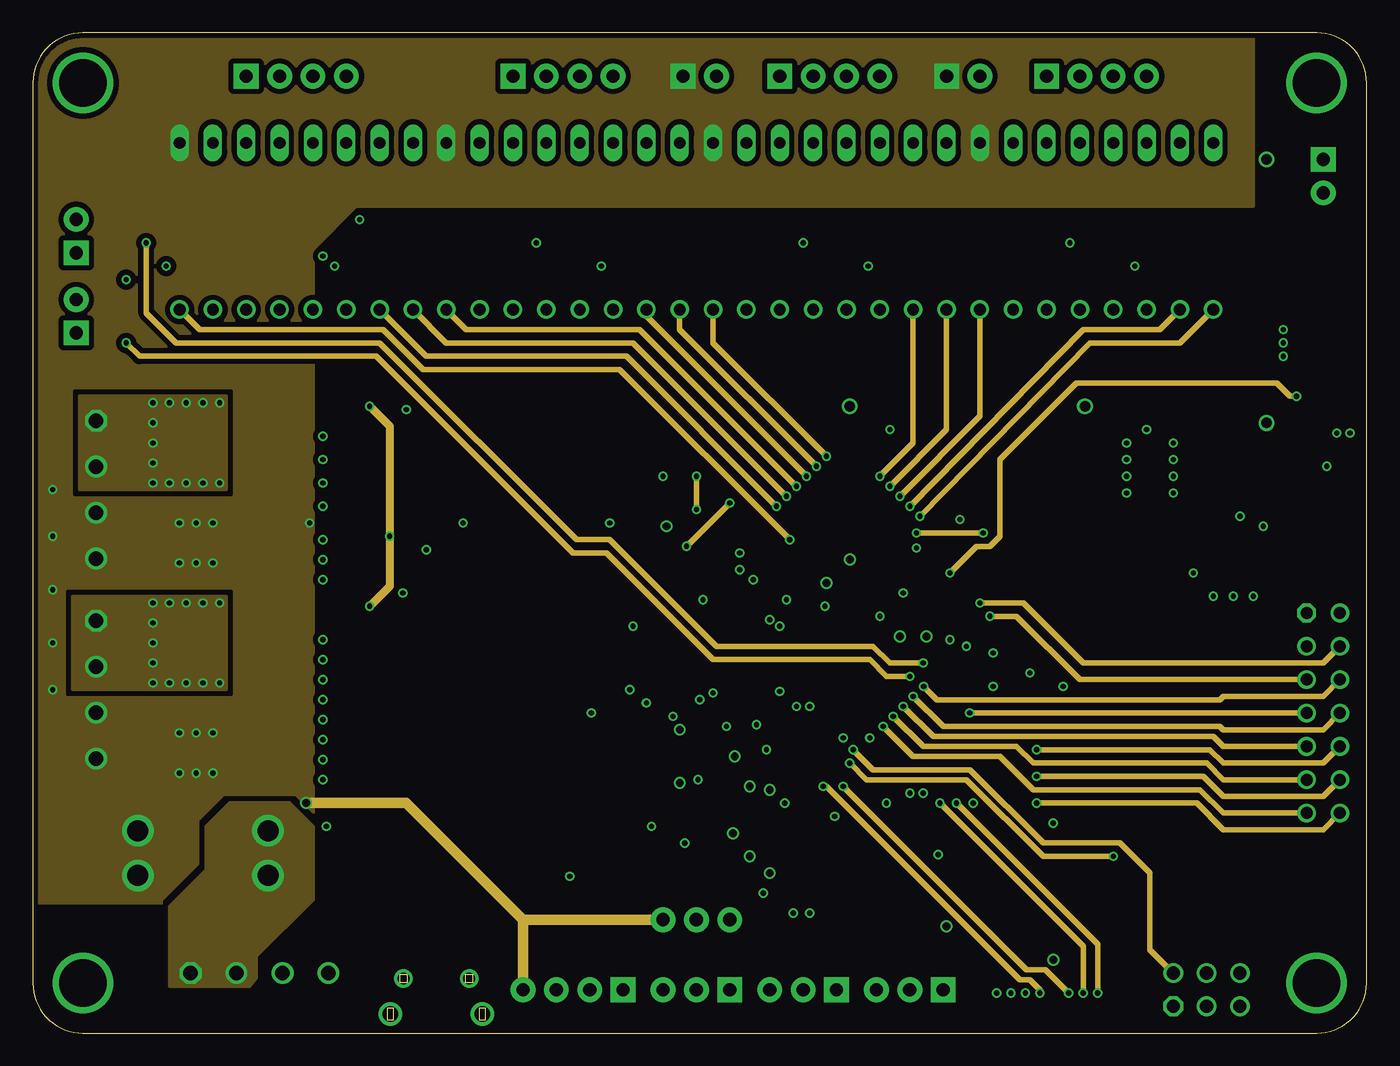
[diagram p3: board, inner layer Route2]
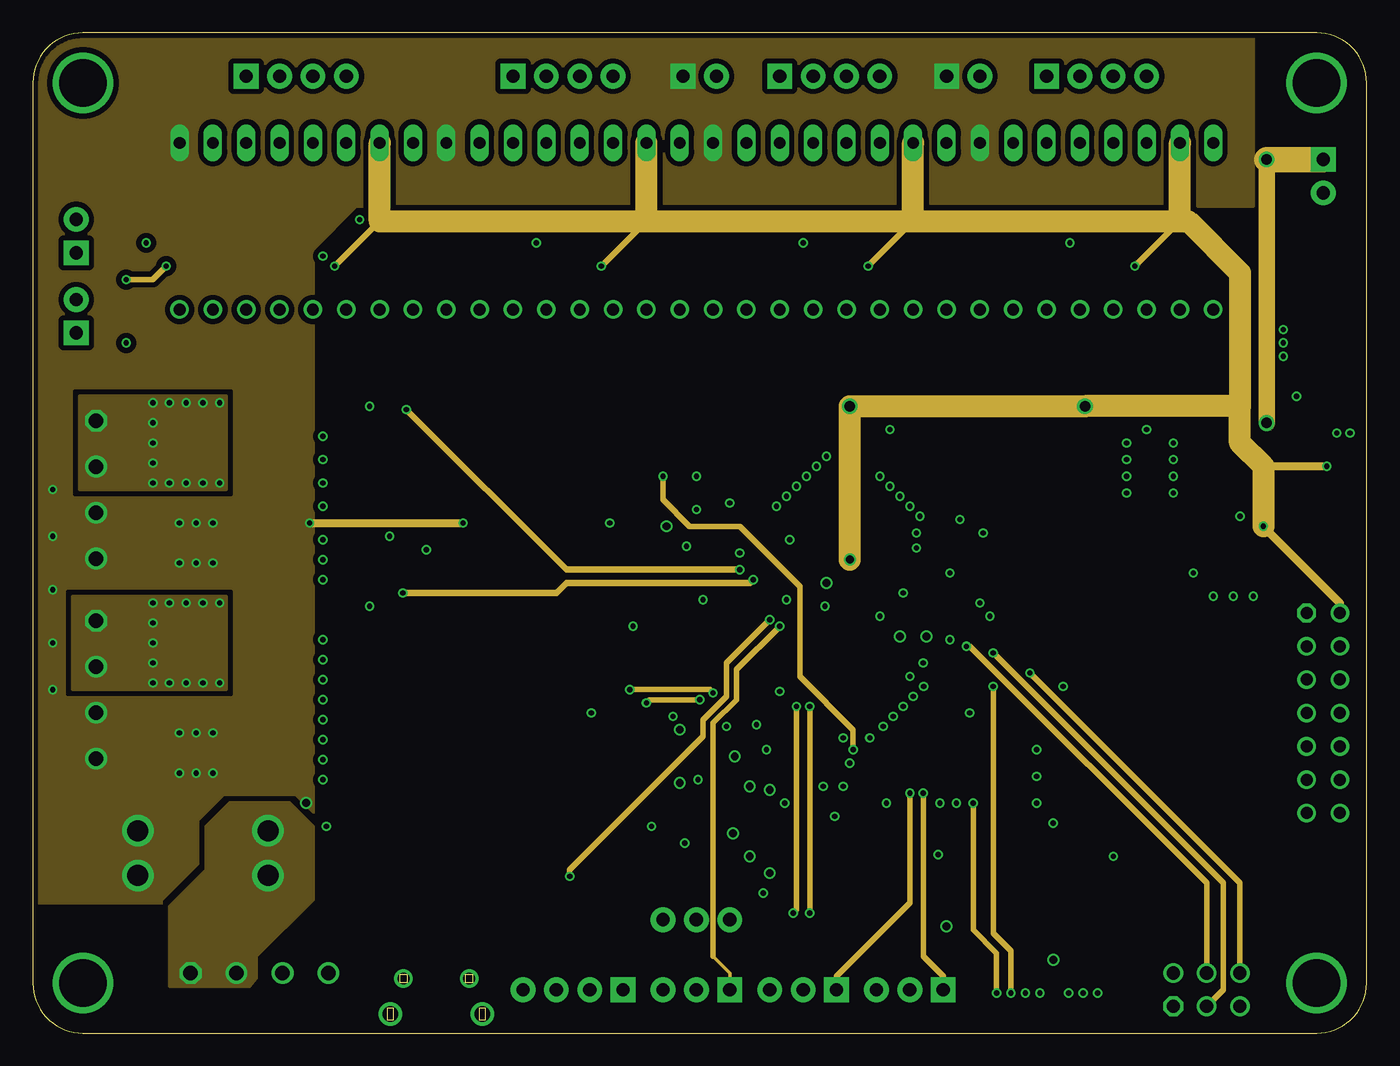
[diagram p4: board, inner layer Route15]
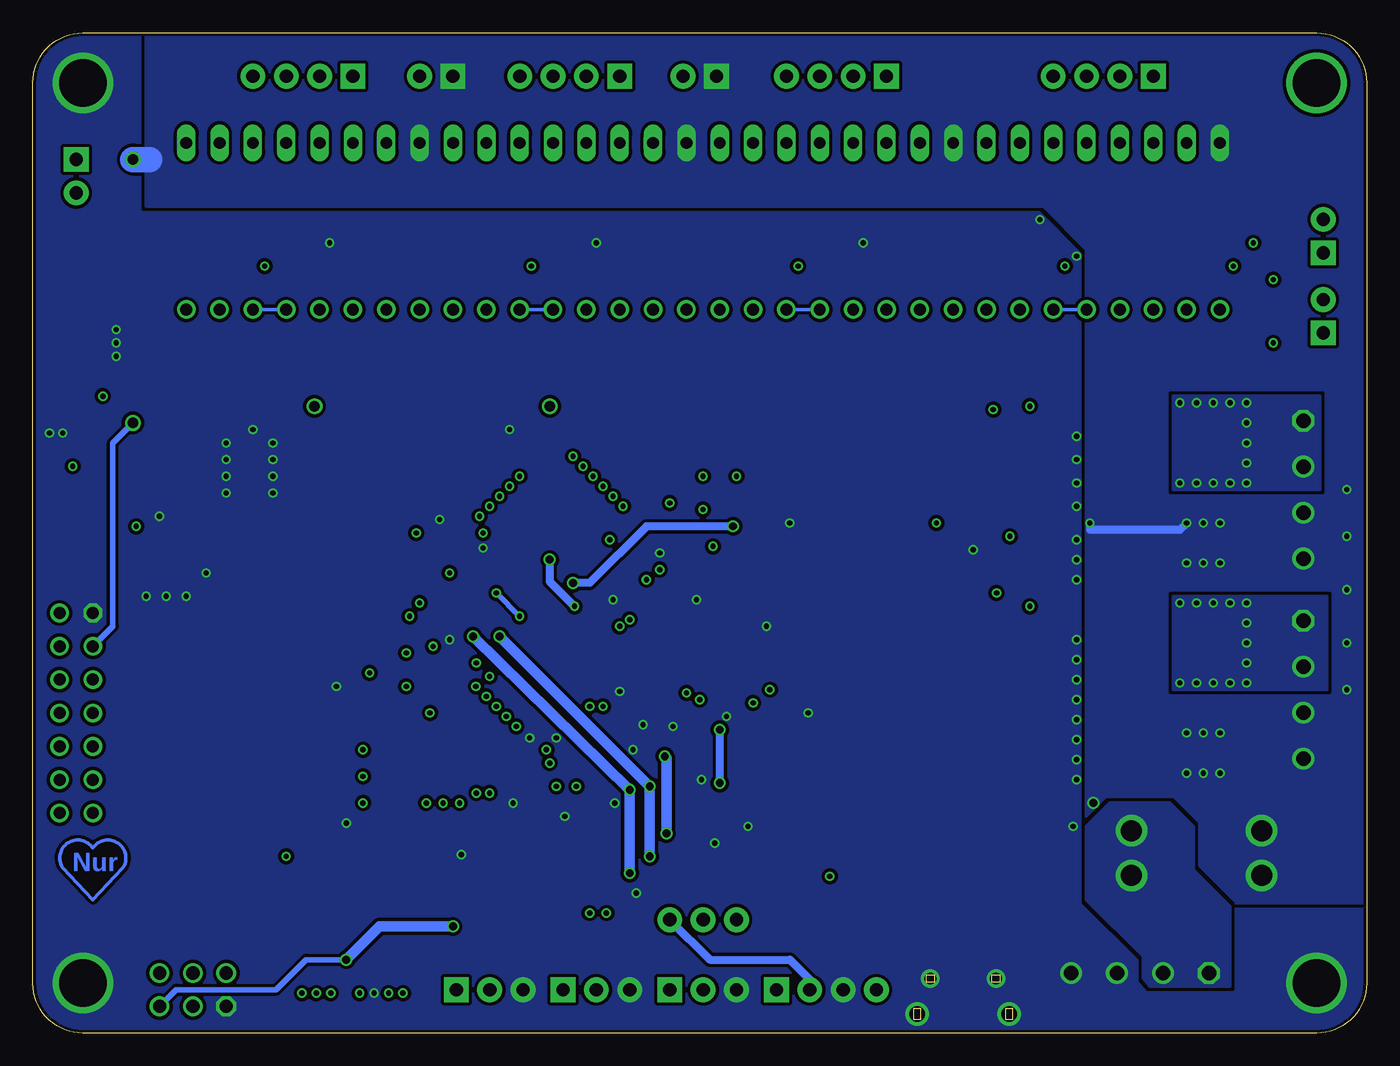
[diagram p5: board, bottom side, seen from below]

Size 101.6 x 76.2 mm. Coordinates in mm from the lower left corner, seen from the top.
Outline: 0,3.81 arc90 3.81,0 97.79,0 arc90 101.6,3.81 101.6,72.39 arc90 97.79,76.2 3.81,76.2 arc90 0,72.39 0,3.81
Copper layers (1*2+15*16): Top 0.035mm / dielectric 1.5mm / Route2 0.035mm / dielectric 0.15mm / Route15 0.035mm / dielectric 0.2mm / Bottom 0.035mm
Design rules "Teensylu Custom *": minimum track width 8mil, minimum drill 15mil, track to track 8mil, track to pad 8mil, pad to pad 8mil, via to via 8mil, smd to smd 0mil, copper to edge 10mil, drill to drill 10mil, minimum pad ring 10mil, minimum via ring 6mil, stop-mask expansion 2mil, vias tented up to drill 100mil, thermal gap 8mil

### Footprints (pad centres in the part's own frame; a part is rotated, then mirrored left to right if it is on the bottom)
CAPC1005X60N = smd 0.65 x 0.65: 1 -0.45,0; 2 0.45,0
CAPC1608X92N = smd 0.9 x 0.95: 1 -0.8,0; 2 0.8,0
CAPC3215X168N = smd 1.15 x 1.65: 1 -1.5,0; 2 1.5,0
PANASONIC_D = smd 3 x 1.4: + 2.4,0; - -2.4,0
CAPC2012X145AN = smd 1.15 x 1.45: 1 -0.9,0; 2 0.9,0
SOD123F = smd 1.34 x 1.8: A 1.43,0; C -1.43,0
MINI_FUSE = drill 1.6: P$1 -4.953,1.702; P$2 -4.953,-1.702; P$3 4.953,-1.702; P$4 4.953,1.702
MINISMDC = smd 1.676 x 3.15: P$1 -2.286,0; P$2 2.489,0
284391-4 = drill 1.1 octagon: 1 -5.25,0 | drill 1.1: 2 -1.753,0; 3 1.753,0; 4 5.25,0
MOLEX-1X2 = drill 1.016 pad 1.88 square: 1 0,0 | drill 1.016 pad 1.88: 2 2.54,0
JP7Q = drill 0.914 octagon: 1 -7.62,-1.27 | drill 0.914: 2 -7.62,1.27; 3 -5.08,-1.27; 4 -5.08,1.27; 5 -2.54,-1.27; 6 -2.54,1.27; 7 0,-1.27; 8 0,1.27; 9 2.54,-1.27; 10 2.54,1.27; 11 5.08,-1.27; 12 5.08,1.27; 13 7.62,-1.27; 14 7.62,1.27
AMPHENOL-MICROSD = smd 0.7 x 1.75: 1 3.636,-5.842; 2 2.536,-5.842; 3 1.436,-5.842; 4 0.336,-5.842; 5 -0.764,-5.842; 6 -1.864,-5.842; 7 -2.964,-5.842; 8 -4.064,-5.842 | smd 1.29 x 1.5: C1 -5.464,-5.717 | smd 1.5 x 1.5: C2 6.086,-5.717 | smd 0.8 x 1.5: C3 -5.539,1.883 | smd 0.8 x 1.4: C4 6.436,2.533 | smd 1.5 x 1: CD1 -5.164,3.383 | smd 1 x 1.55: CD2 6.036,4.958
USB-MICROB-PTH = smd 0.4 x 1.35: D+ 0,2.699; D- -0.65,2.699; GND 1.3,2.699; ID 0.65,2.699; VBUS -1.3,2.699 | drill 1.2 pad 1.676: GND1 -3.5,-0.001; GND6 3.5,-0.001 | smd 1.225 x 1.55: GND2 -2.86,-0.001 | smd 1.5 x 1.55: GND3 -1,-0.001; GND4 1,-0.001 | smd 1.2 x 1.55: GND5 2.86,-0.001 | drill 0.9 pad 1.27: GND7 2.5,2.7; GND8 -2.5,2.7
FIDUCIAL-1X2.5 = smd 1 x 1: 1 0,0
2X05-0.5-SMD = smd 0.76 x 2.4: 1 -2.54,-1.86; 2 -2.54,1.95; 3 -1.27,-1.86; 4 -1.27,1.95; 5 0,-1.86; 6 0,1.95; 7 1.27,-1.86; 8 1.27,1.95; 9 2.54,-1.86; 10 2.54,1.95
ISP = drill 1 octagon: 1 -2.54,-1.27 | drill 1: 2 -2.54,1.27; 3 0,-1.27; 4 0,1.27; 5 2.54,-1.27; 6 2.54,1.27
1X03 = drill 1.016 pad 1.88: 1 0,0; 2 2.54,0; 3 5.08,0
MOLEX-1X4 = drill 1.016 pad 1.88 square: 1 0,0 | drill 1.016 pad 1.88: 2 2.54,0; 3 5.08,0; 4 7.62,0
MOLEX-1X3 = drill 1.016 pad 1.88 square: 1 0,0 | drill 1.016 pad 1.88: 2 2.54,0; 3 5.08,0
FERRITE_BEAD_0805 = smd 1.2 x 1: 1 -1.1,0; 2 1.1,0
SDR0604 = smd 2 x 6: 1 -2.15,0; 2 2.15,0
CHIPLED_0805 = smd 1.2 x 1.2: A 0,-1.05; C 0,1.05
POLOLU-STEPPER-PTH = drill 0.9 long: 1A 6.35,-1.27; 1B 6.35,-3.81; 2A 6.35,1.27; 2B 6.35,3.81; GNDMOT 6.35,6.35; GNDVDD 6.35,-8.89; VDD 6.35,-6.35; VMOT 6.35,8.89 | drill 0.9: !EN -6.35,8.89; !RST -6.35,-1.27; !SLP -6.35,-3.81; DIR -6.35,-8.89; MS1 -6.35,6.35; MS2 -6.35,3.81; MS3 -6.35,1.27; STEP -6.35,-6.35
SOT23C = smd 1 x 1.4: 1 -0.95,-1.1; 2 0.95,-1.1; 3 0,1.1
LFPACK-POWERPAK-SO8 = smd 0.7 x 1.5: 1 -1.905,-2.9; 2 -0.635,-2.9; 3 0.635,-2.9; 4 1.905,-2.9 | smd 0.9 x 0.6: 5-8 0,1.15
RESC1608X55N = smd 0.9 x 1: 1 -0.8,0; 2 0.8,0
RESC1005X40AN = smd 0.6 x 0.6: 1 -0.45,0; 2 0.45,0
SWITCH-SMD-4P = smd 2.1 x 1.4: 1 -4.55,2.25; 2 4.55,2.25; 3 -4.55,-2.25; 4 4.55,-2.25
PLATEDSCREW = drill 3.6: GND 0,0
SJ_2S-TRACE = smd 0.508 x 0.508: 1 -0.508,0; 2 0.508,0
SOT23-5 = smd 0.6 x 0.9: 1 -0.95,-1.15; 2 0,-1.15; 3 0.95,-1.15; 4 0.95,1.15; 5 -0.95,1.15
TSOT6 = smd 0.69 x 1: 1 -0.95,-1.3; 2 0,-1.3; 3 0.95,-1.3; 4 0.95,1.3; 5 0,1.3; 6 -0.95,1.3
SOT89 = smd 0.6 x 1.4: 1 -1.5,0.7; 3 1.5,0.7 | smd 0.6 x 1.6: 2 0,3.34
LQFP100 = smd 0.889 x 0.279: 1 -7.72,6; 2 -7.72,5.5; 3 -7.72,5; 4 -7.72,4.5; 5 -7.72,4; 6 -7.72,3.5; 7 -7.72,3; 8 -7.72,2.5; 9 -7.72,2; 10 -7.72,1.5; 11 -7.72,1; 12 -7.72,0.5; 13 -7.72,0; 14 -7.72,-0.5; 15 -7.72,-1; 16 -7.72,-1.5; 17 -7.72,-2; 18 -7.72,-2.5; 19 -7.72,-3; 20 -7.72,-3.5; 21 -7.72,-4; 22 -7.72,-4.5; 23 -7.72,-5; 24 -7.72,-5.5; 25 -7.72,-6; 51 7.72,-6; 52 7.72,-5.5; 53 7.72,-5; 54 7.72,-4.5; 55 7.72,-4; 56 7.72,-3.5; 57 7.72,-3; 58 7.72,-2.5; 59 7.72,-2; 60 7.72,-1.5; 61 7.72,-1; 62 7.72,-0.5; 63 7.72,0; 64 7.72,0.5; 65 7.72,1; 66 7.72,1.5; 67 7.72,2; 68 7.72,2.5; 69 7.72,3; 70 7.72,3.5; 71 7.72,4; 72 7.72,4.5; 73 7.72,5; 74 7.72,5.5; 75 7.72,6 | smd 0.279 x 0.889: 26 -6,-7.72; 27 -5.5,-7.72; 28 -5,-7.72; 29 -4.5,-7.72; 30 -4,-7.72; 31 -3.5,-7.72; 32 -3,-7.72; 33 -2.5,-7.72; 34 -2,-7.72; 35 -1.5,-7.72; 36 -1,-7.72; 37 -0.5,-7.72; 38 0,-7.72; 39 0.5,-7.72; 40 1,-7.72; 41 1.5,-7.72; 42 2,-7.72; 43 2.5,-7.72; 44 3,-7.72; 45 3.5,-7.72; 46 4,-7.72; 47 4.5,-7.72; 48 5,-7.72; 49 5.5,-7.72; 50 6,-7.72; 76 6,7.72; 77 5.5,7.72; 78 5,7.72; 79 4.5,7.72; 80 4,7.72; 81 3.5,7.72; 82 3,7.72; 83 2.5,7.72; 84 2,7.72; 85 1.5,7.72; 86 1,7.72; 87 0.5,7.72; 88 0,7.72; 89 -0.5,7.72; 90 -1,7.72; 91 -1.5,7.72; 92 -2,7.72; 93 -2.5,7.72; 94 -3,7.72; 95 -3.5,7.72; 96 -4,7.72; 97 -4.5,7.72; 98 -5,7.72; 99 -5.5,7.72; 100 -6,7.72
SOT143-R = smd 1 x 0.7: 1 -0.75,-1 | smd 0.6 x 0.7: 2 0.95,-1; 3 0.95,1; 4 -0.95,1
NDK-XTAL = smd 2 x 2.4: P$1 -2,0; P$2 2,0

### Placement (x,y rotation side)
C1  58.67,12.95 90 top
C2  45.47,38.61 225 top
C3  54.86,15.49 315 top
C4  52.32,17.78 135 top
C5  55.88,17.02 315 top
C6  62.48,15.24 90 top
C7  48.01,34.8 45 top
C8  54.86,39.12 225 top
C9  63.07,46.15 0 top
C10  64.77,14.73 45 top
C11  49.53,32.77 45 top
C12  51.56,21.59 135 top
C13  55.37,37.08 225 top
C14  57.4,15.49 135 top
C15  50.8,13.46 135 top
C16  67.82,12.45 45 top
C17  74.42,25.15 45 top
C18  75.44,24.13 45 top
C19  69.34,38.1 45 top
C20  88.9,44.2 90 top
C21  48.51,17.02 225 top
C22  70.36,37.08 45 top
C23  24.64,32 270 top
C24  50.04,24.38 135 top
C25  66.55,16.51 225 top
C26  53.09,20.07 315 top
C27  44.2,24.89 225 top
C28  86.87,34.04 90 top
C29  14.99,37.34 180 top
C30  81.03,43.94 0 top
C31  24.64,47.24 270 top
C32  81.03,41.66 0 top
C33  31.24,37.85 180 top
C34  46.74,32 90 top
C35  46.74,29.97 270 top
C36  28.7,37.85 0 top
C37  14.99,21.34 180 top
C38  69.6,10.16 90 top
C39  8.64,58.93 90 top
C40  8.64,53.85 270 top
C41  34.04,12.95 315 top
C42  27.69,65.02 180 top
C43  48.01,65.02 180 top
C44  68.33,65.02 180 top
C45  88.65,65.02 180 top
C46  14.22,62.74 180 top
C47  34.54,62.74 180 top
C48  54.86,62.74 180 top
C49  75.18,62.74 180 top
D1  98.3,52.58 180 top
D2  85.09,42.42 90 top
F1  12.95,13.72 180 top
F2  98.3,58.42 90 top
J1  17.27,4.57 0 top
J2  69.6,72.9 0 top
J3  49.53,72.9 0 top
J4  98.3,66.55 270 top
J5  4.83,41.4 270 top
J6  98.3,24.38 270 top
J7  4.83,26.16 270 top
J8  77.47,7.62 0 top
J9  30.73,1.46 0 top
J10  3.3,59.44 90 top
J11  3.3,53.34 90 top
JP1  8.89,72.39 0 top
JP2  97.79,8.89 0 top
JP3  92.71,72.39 0 top
JP4  50.55,45.97 180 top
JP5  89.41,3.3 0 top
JP6  48.01,8.64 0 top
JP7  44.96,3.3 180 top
JP8  61.21,3.3 180 top
JP9  53.09,3.3 180 top
JP10  69.34,3.3 180 top
JP11  16.26,72.9 0 top
JP12  36.58,72.9 0 top
JP13  77.22,72.9 0 top
JP14  56.9,72.9 0 top
L1  60.45,13.46 90 top
L2  46.48,36.83 225 top
L3  51.56,14.99 135 top
L4  67.06,14.22 45 top
L5  82.55,36.58 180 top
LED1  98.55,37.59 180 top
P1  20.07,61.47 90 top
P2  40.39,61.47 90 top
P3  60.71,61.47 90 top
P4  81.03,61.47 90 top
Q1  98.81,48.32 0 top
Q2  13.46,44.96 90 top
Q3  13.46,29.72 90 top
Q4  42.16,10.41 90 top
R1  98.55,41.4 90 top
R2  96.27,50.04 90 top
R3  96.27,46.99 270 top
R4  26.92,48.26 270 top
R5  88.65,40.64 0 top
R6  90.68,40.64 0 top
R7  18.8,46.86 180 top
R8  43.18,25.91 45 top
R9  59.18,10.41 90 top
R10  48.01,26.16 135 top
R11  47.5,22.86 315 top
R12  57.66,10.41 90 top
R13  90.93,37.34 180 top
R14  90.93,35.56 0 top
R15  26.92,33.02 270 top
R16  18.8,31.62 180 top
R17  7.11,58.93 270 top
R18  7.11,53.85 90 top
R19  31.5,57.91 270 top
R20  11.18,57.91 270 top
R21  51.82,57.91 270 top
R22  72.14,57.91 270 top
S1  89.41,14.22 90 top
S2  74.68,45.97 90 top
SCREW1  3.81,72.39 0 top
SCREW2  3.81,3.81 0 top
SCREW3  97.79,72.39 0 top
SCREW4  97.79,3.81 0 top
SJ1  18.8,57.91 90 top
SJ2  39.12,57.91 90 top
SJ3  59.44,57.91 90 top
SJ4  79.76,57.91 90 top
SJ5  16.26,57.91 90 top
SJ6  36.58,57.91 90 top
SJ7  56.9,57.91 90 top
SJ8  77.22,57.91 90 top
SJ9  13.72,57.91 90 top
SJ10  34.04,57.91 90 top
SJ11  54.36,57.91 90 top
SJ12  74.68,57.91 90 top
U1  21.84,47.75 90 top
U2  87.88,37.85 0 top
U3  21.84,32.51 90 top
U4  29.97,39.12 0 top
U5  62.23,29.21 315 top
U6  33.02,9.78 45 top
X1  43.94,30.99 270 top

### Tracks (layer width: path | path; a pad name or v marks a point on that pad's centre or on a via)
5VREG_CB
  Top 0.61: U2.1 86.93,34.9 C28.2
5VREG_FB
  Top 0.406: R13.2 90.48,36.83 90.48,36.55 | 90.48,36.55 R14.1 | U2.3 90.48,36.55
5VREG_SW
  Top 0.406: C28.1 84.7,33.59 L5.1
  Top 0.61: U2.6 85.09,39.15
  Top 0.813: 85.09,39.15 D2.C
  Top 1.27: L5.1 85.09,36.58 D2.C
12V_FUSE
  pour Top (no thermals): 13.21,12.45 13.21,15.75 14.99,17.53 19.56,17.53 21.34,15.75 21.34,10.16 17.02,5.84 17.02,4.19 16.51,3.56 10.41,3.56 10.41,9.65
  pour Route2 (no thermals): 10.41,9.65 13.21,12.45 13.21,15.73 15,17.53 19.56,17.53 21.34,15.75 21.34,10.16 17.02,5.84 17.02,4.19 16.51,3.56 10.41,3.56
  pour Bottom (no thermals): 10.41,9.65 13.21,12.45 13.21,15.73 15,17.53 19.56,17.53 21.34,15.75 21.34,10.16 17.02,5.84 17.02,4.19 16.51,3.56 10.41,3.56
  pour Route15 (no thermals): 10.41,9.65 13.21,12.45 13.21,15.73 15,17.53 19.56,17.53 21.34,15.75 21.34,10.16 17.02,5.84 17.02,4.19 16.51,3.56 10.41,3.56
24V  (via drill 0.4, 0.6, 0.8)
  Top 0.61: C20.1 88.2,41.99 R5.1 87.88,40.33 U2.5 | C33.1 31.69,38.86 | 31.69,38.86 31.69,39.6 U4.3 | v32.77,38.86 31.69,38.86
  Top 1.016: 11.18,62.37 C46.+ | 31.5,62.37 C47.+ | P3.VMOT 51.82,62.37 C48.+ | 72.14,62.37 C49.+ | v93.98,46.48 90.19,42.7 C20.1
  Top 1.27: P1.VMOT 11.18,62.37 | P2.VMOT 31.5,62.37 | P4.VMOT 72.14,62.37
  Route2 0.813: JP6.1 37.34,8.64 | 37.34,8.64 28.45,17.53 v20.83,17.53 | JP7.4 37.34,8.64
  Route15 0.61: v21.08,38.86 v32.77,38.86
  Route15 1.27: v93.98,66.55 v93.98,46.48
  Route15 1.93: J4.1 v93.98,66.55
  Bottom 0.406: v93.98,46.48 95.5,44.96 95.5,30.99 J6.3
  Bottom 0.61: v21.08,38.86 21.08,38.35 14.22,38.35 v13.72,38.86
  Bottom 1.93: v93.98,66.55 92.71,66.55
  other vias: 11.18,22.86 11.18,19.81 12.45,19.81 12.45,22.86 1.52,29.72 1.52,33.78 1.52,37.85 1.52,41.4 1.52,26.16 13.72,22.86 13.72,19.81 12.45,38.86 11.18,38.86 13.72,35.81 12.45,35.81 11.18,35.81
  pour Bottom (isolate 0.254, rank 2, no thermals): 21.34,9.91 21.34,59.69 24.64,62.99 92.96,62.99 92.96,77.98 -1.27,77.98 -1.27,9.91
  pour Top (rank 2, no thermals): 9.91,9.91 0.25,9.91 0.25,42.42 14.22,42.42 14.22,17.53 12.7,16 12.7,12.7
  pour Route15 (isolate 0.406, rank 2, no thermals): 9.91,9.91 0.25,9.91 0.25,42.42 14.22,42.42 14.22,17.53 12.7,16 12.7,12.7
  pour Route2 (isolate 0.406, rank 2, no thermals): 9.91,9.91 0.25,9.91 0.25,42.42 14.22,42.42 14.22,17.53 12.7,16 12.7,12.7
  pour Route15 (isolate 0.406, rank 2, no thermals): 21.34,9.91 21.34,59.69 24.64,62.99 92.96,62.99 92.96,77.98 -1.27,77.98 -1.27,9.91
  pour Route2 (isolate 0.406, rank 2, no thermals): 21.34,9.91 21.34,59.69 24.64,62.99 92.96,62.99 92.96,77.98 -1.27,77.98 -1.27,9.91
!E1-ENABLE  (via drill 0.4)
  Top 0.254: U5.98 66.04,40.09 v66.04,40.89
  Top 0.406: P4.!EN R22.2
  Route2 0.406: v66.04,40.89 72.14,46.99 P4.!EN
!HOTBED  (via drill 0.4)
  Top 0.254: U5.15 55.48,34.54 v54.86,34.54
  Top 0.406: v28.19,33.53 28.14,33.47 R15.1 U3.3
  Route15 0.508: v54.86,34.54 54.61,34.29 40.64,34.29 39.88,33.53 v28.19,33.53
!HOTEND-1  (via drill 0.4)
  Top 0.254: U5.14 55.43,35.31 v53.85,35.31
  Top 0.406: U1.3 R4.1 28,48.71 28.45,48.26 v28.45,47.5
  Route15 0.508: v53.85,35.31 40.64,35.31 v28.45,47.5
!PWM-FAN  (via drill 0.4)
  Top 0.254: U5.85 69.85,34.71 v69.85,35.05
  Top 0.406: R3.1 v96.27,48.51 R2.1
  Route2 0.406: v69.85,35.05 71.88,37.08 72.9,37.08 73.66,37.85 73.66,43.69 79.5,49.53 94.74,49.53 95.76,48.51 v96.27,48.51
!RESET  (via drill 0.4)
  Top 0.254: U5.47 60.97,21.59 v62.48,21.59
  Top 0.406: v48.01,42.42 JP4.10 | JP5.2 86.87,7.11 87.16,7.4 S1.1
  Route2 0.406: v62.48,21.59 64.01,20.07 71.37,20.07 76.96,14.48 82.8,14.48 85.09,12.19 85.09,6.35 JP5.2
  Route15 0.406: v62.48,21.59 62.48,23.11 58.42,27.18 58.42,34.04 53.85,38.61 50.04,38.61 48.01,40.64 v48.01,42.42
!X-ENABLE  (via drill 0.4)
  Top 0.254: U5.7 58.09,37.59 v57.66,37.59
  Top 0.406: P1.!EN R20.2
  Route2 0.406: P1.!EN 12.7,53.59 26.67,53.59 29.72,50.55 44.7,50.55 v57.66,37.59
!Y-ENABLE  (via drill 0.4)
  Top 0.254: U5.4 58.67,39.13 58.67,41.15 v58.17,41.66
  Top 0.406: P2.!EN R19.2
  Route2 0.406: P2.!EN 33.02,53.59 46.23,53.59 v58.17,41.66
!Z-ENABLE  (via drill 0.4)
  Top 0.254: U5.1 60.45,39.47 v60.45,43.94
  Top 0.406: P3.!EN R21.2
  Route2 0.406: v60.45,43.94 51.82,52.58 P3.!EN
+3V3  (via drill 0.4, 0.6, 0.8)
  Top 0.254: U5.39 56.33,22.61 | U5.43 57.4,20.85 57.4,20.57 | 68.58,37.34 68.58,36.97 U5.90 65.01,33.4 64.9,33.4 | v60.34,32.51 U5.11 56.02,36.83 | 68.83,29.46 68.83,28.97 U5.72 72.98,24.83 73.15,24.83 | 59.18,12.25 C1.1
  Top 0.406: v83.95,58.42 SJ4.2 SJ8.2 SJ12.2 72.19,58.42 R22.1 | v63.63,58.42 SJ3.2 SJ7.2 SJ11.2 51.87,58.42 R21.1 | v43.31,58.42 SJ2.2 SJ6.2 SJ10.2 31.55,58.42 R19.1 | v22.99,58.42 SJ1.2 SJ5.2 SJ9.2 11.23,58.42 R20.1 10.22,58.36 v10.16,58.42 | 56.33,22.61 54.99,22.61 v53.47,21.08 C26.1 | 68.58,37.34 C19.1 | 57.4,20.32 57.4,20.57 | R9.2 59.18,12.25 | 73.15,24.83 C17.1 | R18.2 v7.11,57.4 R17.2 | 56.02,36.83 56.02,37.07 C13.1 | C32.1 78.23,41.66 78,41.42 S2.3
  Top 0.61: v62.23,47.75 53.34,47.75 53.26,47.83 JP4.1 | J8.4 77.81,4.06 | 77.81,4.06 77.81,4.15 | 92.46,37.34 R13.1 | L3.1 51.85,13.72 51.69,13.72 C15.1 53.09,11.18 JP6.3 | 53.45,15.21 v53.34,15.21 | v56.13,18.54 56.13,19.05 57.4,20.32 | v68.07,30.23 68.83,29.46 | v77.72,5.59 77.72,4.15 77.81,4.06 | C38.1 68.62,9.36 67.5,10.48 C16.1 66.28,13.35 L4.1 65.19,12.36 L1.1 60.56,12.5 C1.1 56.45,12.5 v56.13,12.19 | C5.1 55.37,17.53 55.12,17.53 | v98.55,43.18 R1.2
  Top 0.813: v93.73,38.61 92.46,37.34 | L3.1 v53.34,15.21 | 53.45,15.21 C3.1 54.86,16.62 54.86,17.27 55.12,17.53 v56.13,18.54 | v68.07,30.23 64.9,33.4 v62.23,36.07 | C38.1 v69.6,8.13 | C9.1 62.23,46.19 v62.23,47.75 | P1.VDD 26.42,65.49 C42.2 | P2.VDD 46.74,65.49 C43.2 | P3.VDD 67.06,65.49 C44.2 | P4.VDD 87.38,65.49 C45.2
  Top 1.27: v80.14,47.75 80.14,43.95 C30.1 C32.1 80.13,36.85 L5.2
  Route15 0.406: v83.95,58.42 87.38,61.85 | v22.99,58.42 26.42,61.85 | v43.31,58.42 46.74,61.85 | v63.63,58.42 67.06,61.85 | v10.16,58.42 9.14,57.4 v7.11,57.4
  Route15 0.61: J6.2 99.57,32.77 v93.73,38.61 | 93.73,43.18 v98.55,43.18
  Route15 1.676: 91.95,47.75 91.95,44.96 93.73,43.18 v93.73,38.61 | 91.95,47.75 v80.14,47.75 v62.23,47.75 v62.23,36.07 | 67.06,61.85 87.38,61.85 | 87.38,61.85 88.01,61.85 91.95,57.91 91.95,47.75 | 46.74,61.85 67.06,61.85 | 46.74,61.85 26.42,61.85 P1.VDD | 46.74,61.85 P2.VDD | 67.06,61.85 P3.VDD | 87.38,61.85 P4.VDD
  Bottom 0.406: JP5.5 90.68,3.3 83.06,3.3 80.77,5.59 v77.72,5.59
  Bottom 0.61: JP6.3 50.04,5.59 43.94,5.59 42.42,4.06 JP7.2 | v62.23,36.07 62.23,34.4 v60.34,32.51
  Bottom 0.813: v53.34,15.21 53.34,20.96 v53.47,21.08 | v56.13,12.19 v56.13,18.54 v68.07,30.23 | v69.6,8.13 75.18,8.13 v77.72,5.59
+15V  (via drill 0.4)
  Top 0.61: U4.1 28.25,39.6 C36.1 v27.18,37.85 | v25.65,32.51 25.6,32.45 C23.1 23.05,32.45 U3.2 | v25.65,47.75 25.6,47.69 C31.1 23.05,47.69 U1.2
  Route2 0.61: v25.65,32.51 27.18,34.04 v27.18,37.85 27.18,46.23 v25.65,47.75
AD3  (via drill 0.4)
  Top 0.254: U5.60 65.95,23.37 v64.77,23.37
  Route2 0.406: v64.77,23.37 67.06,21.08 73.66,21.08 76.2,18.54 88.9,18.54 90.68,16.76 J6.13
ADVREF
  Top 0.254: U5.53 65.83,18.54 65.83,17.87 C25.1
  Top 0.61: L4.2 67.83,15.86 C25.1
B-THERM  (via drill 0.4)
  Top 0.254: U5.69 68.5,27.18 v66.8,27.18
  Top 0.406: v7.11,52.58 R18.1 | C40.2 R18.1 | R18.1 7.05,53.34 J11.1
  Route2 0.406: v66.8,27.18 65.02,27.18 63.75,28.45 51.82,28.45 43.69,36.58 41.15,36.58 26.16,51.56 8.13,51.56 v7.11,52.58
E1-DIR  (via drill 0.4)
  Top 0.254: U5.96 66.73,39.37 v67.56,39.37
  Route2 0.406: v67.56,39.37 80.52,52.58 87.38,52.58 P4.DIR
E1-STEP  (via drill 0.4)
  Top 0.254: U5.97 66.28,39.62 v66.8,40.13
  Route2 0.406: v66.8,40.13 80.01,53.59 85.85,53.59 P4.STEP
E1-THERM  (via drill 0.4)
  Top 0.254: U5.70 68.2,28.19 v67.82,28.19
  Top 0.406: v8.64,60.2 C39.2 R17.1 7.05,59.44 J10.1
  Route2 0.406: v67.82,28.19 65.28,28.19 64.01,29.46 52.07,29.46 43.94,37.59 41.4,37.59 26.42,52.58 10.92,52.58 8.64,54.86 v8.64,60.2
E-MOT-1A
  Top 1.27: P4.1A JP13.3
E-MOT-1B
  Top 1.27: P4.1B JP13.4
E-MOT-2A
  Top 1.27: P4.2A JP13.2
E-MOT-2B
  Top 1.27: P4.2B JP13.1
E-MS1
  Top 0.406: P4.MS1 SJ12.1
E-MS2
  Top 0.406: P4.MS2 SJ8.1
E-MS3
  Top 0.406: P4.MS3 SJ4.1
E-RESETSLEEP
  Bottom 0.254: P4.!RST P4.!SLP
E-STOP  (via drill 0.4)
  Top 0.254: U5.55 66.22,19.56 66.8,19.56 67.82,18.54 v67.82,18.29
  Route15 0.406: v67.82,18.29 67.82,5.84 69.34,4.32 JP10.1
ENDSTOP+V
  Top 0.406: 58.67,2.03 57.91,1.27 51.31,1.27 50.55,2.03 JP9.2 JP6.2 | JP8.2 58.67,2.03 | 58.67,2.03 59.44,1.27 65.79,1.27 66.8,2.29 JP10.2
ERASE  (via drill 0.4)
  Top 0.254: U5.95 66.17,38.1 v67.31,38.1
  Top 0.406: v72.39,38.1 72.39,41.4 S2.1
  Route2 0.406: v67.31,38.1 v72.39,38.1
GND  (via drill 0.4)
  other vias: 45.72,30.99 89.92,33.27 75.61,3.05 86.87,42.42 91.44,33.27 100.33,45.72 22.1,29.97 22.1,36.07 22.1,59.18 22.1,28.45 22.35,15.75 22.1,26.92 22.1,25.4 22.1,23.88 22.1,34.54 22.1,37.59 58.67,60.2 68.96,13.59 38.35,60.2 22.1,22.35 88.39,35.05 84.84,45.97 86.87,41.15 86.87,43.69 83.31,43.69 83.31,42.42 83.31,41.15 92.96,33.27 95.25,53.59 95.25,51.56 78.99,60.2 48.77,24.13 22.1,40.13 22.1,41.91 95.25,52.58 77.72,16 22.1,43.69 83.31,44.96 86.87,44.96 91.95,39.37 99.31,45.72 24.89,61.98 22.1,20.83 22.1,19.3 55.88,21.59 57.28,17.53 65.02,17.53 51.05,33.02 56.9,26.04 55.63,10.67 52.83,23.37 61.09,16.51 53.85,36.58 22.1,45.47 63.75,22.48 67.31,36.96 55.12,23.5 50.67,19.3 43.94,38.86 65.28,45.97 29.97,36.83 70.61,39.12 47.12,15.75 49.66,14.48 42.55,24.38 57.4,33.02 69.85,29.97 78.49,26.42 61.72,22.48
  pour Top (isolate 0.203, rank 6): -6.35,78.23 106.68,78.23 106.68,-3.05 -6.35,-3.05
  pour Bottom (isolate 0.254, rank 6, no thermals): -5.08,76.96 105.41,76.96 105.41,-1.78 -5.08,-1.78
  pour Bottom (rank 2, no thermals): 24.13,5.59 18.08,5.59 17.53,5.03 17.53,3.94 16.76,3.05 10.41,3.05 10.41,0 24.13,0
HOTBED-GND  (via drill 0.4)
  other vias: 9.14,32.77 10.41,32.77 11.68,32.77 12.95,32.77 14.22,32.77 14.22,26.67 12.95,26.67 11.68,26.67 10.41,26.67 9.14,26.67 9.14,28.19 9.14,29.72 9.14,31.24
  pour Bottom (no thermals): 3.05,33.27 14.73,33.27 14.73,26.16 3.05,26.16
  pour Top (no thermals): 3.05,33.27 14.73,33.27 14.73,26.16 3.05,26.16
  pour Route2 (no thermals): 3.05,33.27 14.73,33.27 14.73,26.16 3.05,26.16
  pour Route15 (no thermals): 3.05,33.27 14.73,33.27 14.73,26.16 3.05,26.16
HOTEND-GND  (via drill 0.4)
  other vias: 9.14,48.01 9.14,41.91 9.14,43.43 9.14,44.96 9.14,46.48 14.22,48.01 12.95,48.01 11.68,48.01 10.41,48.01 10.41,41.91 11.68,41.91 12.95,41.91 14.22,41.91
  pour Bottom (no thermals): 3.56,48.51 14.73,48.51 14.73,41.4 3.56,41.4
  pour Route15 (no thermals): 3.56,48.51 14.73,48.51 14.73,41.4 3.56,41.4
  pour Route2 (no thermals): 3.56,48.51 14.73,48.51 14.73,41.4 3.56,41.4
  pour Top (no thermals): 3.56,48.51 14.73,48.51 14.73,41.4 3.56,41.4
JTAG_TCK
  Top 0.254: U5.18 51.82,36.09 JP4.4
JTAG_TDI
  Top 0.254: U5.19 51.31,35.89 51.31,40.39 49.28,42.42
  Top 0.406: 49.28,42.42 JP4.8
JTAG_TDO  (via drill 0.4)
  Top 0.254: U5.20 50.55,35.94 v50.55,39.88
  Top 0.406: v50.55,42.42 JP4.6
  Route2 0.406: v50.55,39.88 v50.55,42.42
JTAG_TMS  (via drill 0.4)
  Top 0.254: U5.21 49.78,36 v49.78,37.08
  Top 0.406: v53.09,40.39 JP4.2
  Route2 0.406: v49.78,37.08 v53.09,40.39
MCCDA  (via drill 0.4)
  Top 0.254: U5.50 61.47,19.05 v61.72,18.8
  Top 0.406: v78.91,3.05 J8.3
  Route2 0.406: v61.72,18.8 75.69,4.83 77.13,4.83 v78.91,3.05
MCCK  (via drill 0.4)
  Top 0.254: U5.49 60.2,19.4 v60.2,18.8
  Top 0.406: v76.71,3.05 76.71,2.54 J8.5
  Route2 0.406: v60.2,18.8 60.45,18.8 75.18,4.06 75.95,4.06 76.71,3.3 v76.71,3.05
MCDA0  (via drill 0.4)
  Top 0.254: U5.74 72.8,26.42 v73.15,26.42
  Top 0.406: v74.51,3.05 J8.7
  Route15 0.406: v73.15,26.42 73.15,7.62 74.51,6.27 v74.51,3.05
MCDA1  (via drill 0.4)
  Top 0.254: U5.59 68.55,20.07 69.09,20.07 v71.63,17.53
  Top 0.406: v73.41,3.05 J8.8
  Route15 0.406: v71.63,17.53 71.63,7.87 73.41,6.1 v73.41,3.05
MCDA2  (via drill 0.4)
  Top 0.254: U5.58 68.35,19.56 68.58,19.56 70.36,17.78 v70.36,17.53
  Top 0.406: J8.1 v81.11,3.05
  Route2 0.406: v81.11,3.05 81.11,6.78 v70.36,17.53
MCDA3  (via drill 0.4)
  Top 0.254: U5.57 68.15,19.05 68.33,19.05 69.09,18.29 v69.09,17.53
  Top 0.406: v80.01,3.05 80.01,2.79 J8.2
  Route2 0.406: v80.01,3.05 80.01,6.6 v69.09,17.53
MISO  (via drill 0.4)
  Top 0.254: U5.75 72.49,27.43 v75.95,27.43
  Route15 0.406: JP5.6 91.95,11.43 v75.95,27.43
MOSI  (via drill 0.4)
  Top 0.254: U5.76 73.15,29.21 v73.15,28.96
  Route15 0.406: v73.15,28.96 90.68,11.43 90.68,3.3 JP5.3
N$1
  Top 0.406: LED1.A R1.1
N$2
  Top 0.61: R16.2 Q3.4
N$3
  Top 0.406: U2.4 88.83,39.81 89.1,40.07 R5.2 R6.1
N$4  (via drill 0.4)
  Top 0.254: U5.40 59.18,24.75 v59.18,24.89
  Top 0.406: v59.18,9.14 R9.1
  Route15 0.406: v59.18,24.89 v59.18,9.14
N$5
  Top 1.422: F2.P$2 J4.2
N$6
  Top 1.016: Q1.3 98.81,50.29 99.73,51.21 D1.C 99.73,53.69 98.3,55.12 F2.P$1
N$7  (via drill 0.4)
  Top 0.254: U5.38 57.91,24.89 v58.17,24.89
  Top 0.406: v57.91,9.14 57.66,9.4 R12.1
  Route15 0.406: v58.17,24.89 58.17,9.4 v57.91,9.14
N$8
  Bottom 0.254: 99.31,12.57 arc180 97.03,14.1 arc180 94.74,12.57 97.03,10.16 99.31,12.57
N$9
  Top 0.254: U5.32 55.12,26.34 55.12,27.43 53.21,29.34 51.44,29.34 48.77,26.67 47.88,26.67 R10.2
N$10
  Top 0.406: R3.2 97.17,46.54 Q1.1
N$11
  Top 0.61: R7.2 Q2.4
N$12
  Top 0.254: U5.31 48.64,20.57 48.01,20.57 47.24,21.34 47.24,21.97 R11.2
N$14
  Top 0.61: R16.1 19.31,31.56 U3.5
N$15
  Top 0.61: R7.1 19.31,46.8 U1.5
PA2  (via drill 0.4)
  Top 0.254: U5.63 69.34,22.1 73.91,22.1 v76.45,19.56
  Route2 0.406: v76.45,19.56 89.15,19.56 90.68,18.03 98.3,18.03 J6.12
PA3  (via drill 0.4)
  Top 0.254: U5.62 66.6,24.13 v65.53,24.13
  Route2 0.406: v65.53,24.13 67.82,21.84 74.93,21.84 76.2,20.57 89.41,20.57 90.68,19.3 J6.11
PA4  (via drill 0.4)
  Top 0.254: U5.61 68.94,21.08 72.9,21.08 v76.45,17.53
  Route2 0.406: v76.45,17.53 88.65,17.53 90.68,15.49 98.3,15.49 J6.14
PA28  (via drill 0.4)
  Top 0.254: U5.78 71.84,31.75 v72.9,31.75
  Route2 0.406: v72.9,31.75 74.93,31.75 79.76,26.92 J6.5
PA29  (via drill 0.4)
  Top 0.254: U5.79 72.14,32.75 v72.14,32.77
  Route2 0.406: v72.14,32.77 75.44,32.77 80.01,28.19 98.3,28.19 J6.4
PB12  (via drill 0.4)
  Top 0.254: U5.64 67.25,24.89 v66.29,24.89
  Route2 0.406: J6.9 90.68,21.84 89.92,22.61 68.58,22.61 v66.29,24.89
PB13  (via drill 0.4)
  Top 0.254: U5.65 69.74,23.11 73.91,23.11 75.44,21.59 v76.45,21.59
  Route2 0.406: v76.45,21.59 89.66,21.59 90.68,20.57 98.3,20.57 J6.10
PB17  (via drill 0.4)
  Top 0.254: U5.66 67.91,25.65 v67.06,25.65
  Route2 0.406: v67.06,25.65 69.34,23.37 90.42,23.37 90.68,23.11 98.3,23.11 J6.8
PB18  (via drill 0.4)
  Top 0.254: U5.67 v67.85,26.42
  Route2 0.406: J6.6 98.3,25.65 90.68,25.65 90.42,25.4 68.87,25.4 v67.85,26.42
PB19  (via drill 0.4)
  Top 0.254: U5.68 70.59,24.38 v71.35,24.38
  Route2 0.406: v71.35,24.38 J6.7
SCLK  (via drill 0.4)
  Top 0.254: U5.77 71.12,30.32 v71.12,29.46
  Route15 0.406: v71.12,29.46 71.37,29.46 89.41,11.43 JP5.4
SDCD  (via drill 0.4)
  Top 0.254: v62.23,20.57 61.98,20.83 60.92,20.83 U5.48 | J8.CD2 82.62,13.46 v82.3,13.46
  Route2 0.406: v62.23,20.57 63.5,19.3 71.12,19.3 76.96,13.46 v82.3,13.46
USB_DN
  Top 0.254: J9.D- 30.08,7.22 32.98,10.12 U6.3 34.02,11.16 48.32,25.46 R10.1 48.7,25.84 51.69,28.83 52.96,28.83 53.34,28.45 53.34,28.1 U5.27
USB_DP
  Top 0.254: U5.26 51.97,27.43 51.05,27.43 47.18,23.56 R11.1 46.8,23.18 37.59,13.97 37.59,13.46 37.85,13.21 37.85,12.7 37.59,12.45 37.08,12.45 36.83,12.7 36.32,12.7 36.07,12.45 36.07,11.94 36.32,11.68 36.32,11.18 36.07,10.92 35.56,10.92 35.31,11.18 34.8,11.18 34.4,10.78 U6.2 33.37,9.74 30.73,7.11 30.73,6.6 arc60 30.99,6.35 arc-120 30.99,5.33 arc60 30.73,5.08 J9.D+
VBG  (via drill 0.4)
  Top 0.254: U5.29 52.56,25.91 v51.82,25.91
  Top 0.406: R8.2 C27.1 v45.47,26.16
  Route15 0.406: v51.82,25.91 51.56,26.16 v45.47,26.16
VBUS  (via drill 0.4)
  Top 0.254: U5.28 52.62,26.67 51.31,26.67 50.8,26.16 v50.8,25.4
  Top 0.406: v46.74,25.15 46.74,25.02 C41.2 33.91,12.19 32.77,12.19 32,11.43 32,10.18 U6.4 29.43,7.61 J9.VBUS
  Route15 0.406: v46.74,25.15 46.99,25.4 v50.8,25.4
VDD  (via drill 0.4, 0.6)
  Top 0.254: C12.1 53.85,23.24 53.85,23.66 U5.34 | U5.45 58.67,20.7 58.67,16.13 | 69.85,36.58 68.89,36.58 U5.89 66.29,33.98 v66.29,33.53 | 57.09,21.28 57.13,21.28 U5.42 | 67.89,29.21 U5.71 72.97,24.13 | 56.64,37.97 56.64,36.92 U5.10 59.27,34.29 59.44,34.29
  Top 0.305: 57.09,21.28 56.77,20.95 | 67.89,29.21 67.06,29.21
  Top 0.406: 69.85,36.58 C22.1 | 56.77,20.95 56.64,20.83 | C14.1 58.67,16.13 | 59.44,34.29 v60.45,34.29 | 67.06,29.21 v66.04,30.23 | C18.1 73.28,23.81 72.97,24.13 | C8.1 56.64,37.97
  Top 0.61: C4.1 53.71,18.03 53.85,18.03 | 53.85,18.03 51.56,20.32 51.56,20.95 C12.1 | 53.85,18.03 v54.61,18.8 56.64,20.83 | v54.61,13.46 56.01,13.46 C14.1 | v48.26,38.61 L2.1 47.1,37.61 C2.1
  Top 0.813: v66.04,30.23 v64.52,31.75 61.98,34.29 v60.45,34.29
  Bottom 0.406: v66.29,33.53 v64.52,31.75
  Bottom 0.61: v48.26,38.61 54.86,38.61 59.18,34.29 v60.45,34.29
  Bottom 0.813: v66.04,30.23 v54.61,18.8 v54.61,13.46
VDDANA
  Top 0.254: 64.01,18.54 64.01,18.95 U5.51
  Top 0.406: 64.01,18.54 64.01,14.86 C10.1
  Top 0.61: L1.2 60.57,14.44 C6.1 62.51,14.41 C10.1
VDDPLL
  Top 0.254: 52.11,32 52.37,32 U5.23
  Top 0.406: 52.11,32 49.66,32 C11.1
  Top 0.61: C11.1 47.69,33.97 C7.1 45.7,35.97 L2.2
VDDUTMI  (via drill 0.6)
  Top 0.254: U5.30 51.43,24.07 C24.1
  Top 0.61: v49.28,23.11 49.4,23.11 C24.1 | v49.28,19.05 49.28,17.64 C21.1 49.78,16.88 49.78,16.76 L3.2
  Bottom 0.61: v49.28,19.05 v49.28,23.11
X-DIR  (via drill 0.4)
  Top 0.254: U5.5 58.17,38.93 58.17,40.13 v57.4,40.89
  Route2 0.406: P1.DIR 31.5,52.58 45.72,52.58 v57.4,40.89
X-MOT-1A
  Top 1.27: P1.1A JP11.3
X-MOT-1B
  Top 1.27: P1.1B JP11.4
X-MOT-2A
  Top 1.27: P1.2A JP11.2
X-MOT-2B
  Top 1.27: P1.2B JP11.1
X-MS1
  Top 0.406: SJ9.1 P1.MS1
X-MS2
  Top 0.406: SJ5.1 P1.MS2
X-MS3
  Top 0.406: SJ1.1 P1.MS3
X-RESETSLEEP
  Bottom 0.254: P1.!RST P1.!SLP
X-STEP  (via drill 0.4)
  Top 0.254: U5.6 57.66,38.73 57.66,39.12 v56.64,40.13
  Route2 0.406: P1.STEP 29.97,51.56 45.21,51.56 v56.64,40.13
X-STOP  (via drill 0.4)
  Top 0.254: U5.54 66.28,18.8 v66.8,18.29
  Route15 0.406: v66.8,18.29 66.8,9.91 61.21,4.32 JP8.1
XTAL1
  Top 0.254: 44.22,29.01 X1.P$2 46.2,28.99 C35.2 47.56,29.52 48.51,30.48 52.48,30.48 U5.25
XTAL2
  Top 0.254: U5.24 52.42,31.24 48.51,31.24 47.3,32.45 C34.2 46.2,32.99 X1.P$1 44.22,32.96
Y-DIR  (via drill 0.4)
  Top 0.254: U5.2 59.69,39.53 v59.69,43.18
  Route2 0.406: v59.69,43.18 49.28,53.59 P2.DIR
Y-MOT-1A
  Top 1.27: P2.1A JP12.3
Y-MOT-1B
  Top 1.27: P2.1B JP12.4
Y-MOT-2A
  Top 1.27: P2.2A JP12.2
Y-MOT-2B
  Top 1.27: P2.2B JP12.1
Y-MS1
  Top 0.406: P2.MS1 SJ10.1
Y-MS2
  Top 0.406: P2.MS2 SJ6.1
Y-MS3
  Top 0.406: P2.MS3 SJ2.1
Y-RESETSLEEP
  Bottom 0.254: P2.!RST P2.!SLP
Y-STEP  (via drill 0.4)
  Top 0.254: U5.3 59.18,39.33 59.18,42.16 v58.93,42.42
  Route2 0.406: P2.STEP 46.74,54.61 v58.93,42.42
Y-STOP  (via drill 0.4)
  Top 0.254: U5.16 56.9,32.42 v56.9,30.99
  Route15 0.254: 51.82,5.84 53.09,4.57 JP9.1
  Route15 0.406: v56.9,30.99 53.59,27.69 53.59,25.4 51.82,23.62 51.82,5.84
Z-DIR  (via drill 0.4)
  Top 0.254: U5.99 65.28,40.04 v65.28,41.66
  Route2 0.406: v65.28,41.66 69.6,45.97 P3.DIR
Z-MOT-1A
  Top 1.27: P3.1A JP14.3
Z-MOT-1B
  Top 1.27: P3.1B JP14.4
Z-MOT-2A
  Top 1.27: P3.2A JP14.2
Z-MOT-2B
  Top 1.27: P3.2B JP14.1
Z-MS1
  Top 0.406: P3.MS1 SJ11.1
Z-MS2
  Top 0.406: P3.MS2 SJ7.1
Z-MS3
  Top 0.406: P3.MS3 SJ3.1
Z-RESETSLEEP
  Bottom 0.254: P3.!RST P3.!SLP
Z-STEP  (via drill 0.4)
  Top 0.254: U5.100 64.52,39.98 v64.52,42.42
  Route2 0.406: v64.52,42.42 67.06,44.96 P3.STEP
Z-STOP  (via drill 0.4)
  Top 0.254: U5.17 56.13,32.48 v56.13,31.5
  Top 0.406: v40.89,11.94 41.06,11.77 Q4.3
  Route15 0.406: v56.13,31.5 52.83,28.19 52.83,25.65 51.05,23.88 51.05,22.61 40.89,12.45 v40.89,11.94
Z-STOP-BIAS
  Top 0.406: Q4.1 44.96,7.77 JP7.1

### Text on the board
Bottom: Nur
_tsilk: 2B 2A 1A 1B | 2B 2A 1A 1B | +24V | GND | 2B 2A 1A 1B | +24V | GND | 2B 2A 1A 1B | +24V | E1-THRM | GND | B-THRM | https://github.com/StephS/Espressylu | +24V | 1 | Espressylu | Rev. 0.7 | +24V | Licensed CC-BY-SA | 14 | +24V | +5V | +24V | +24V | GND | GND | Z-STOP | +24V | GND | +5V | SIG | Y-STOP | X-STOP | E-STOP